# EasyEDA Pro project oxo.epro, board 114514_1
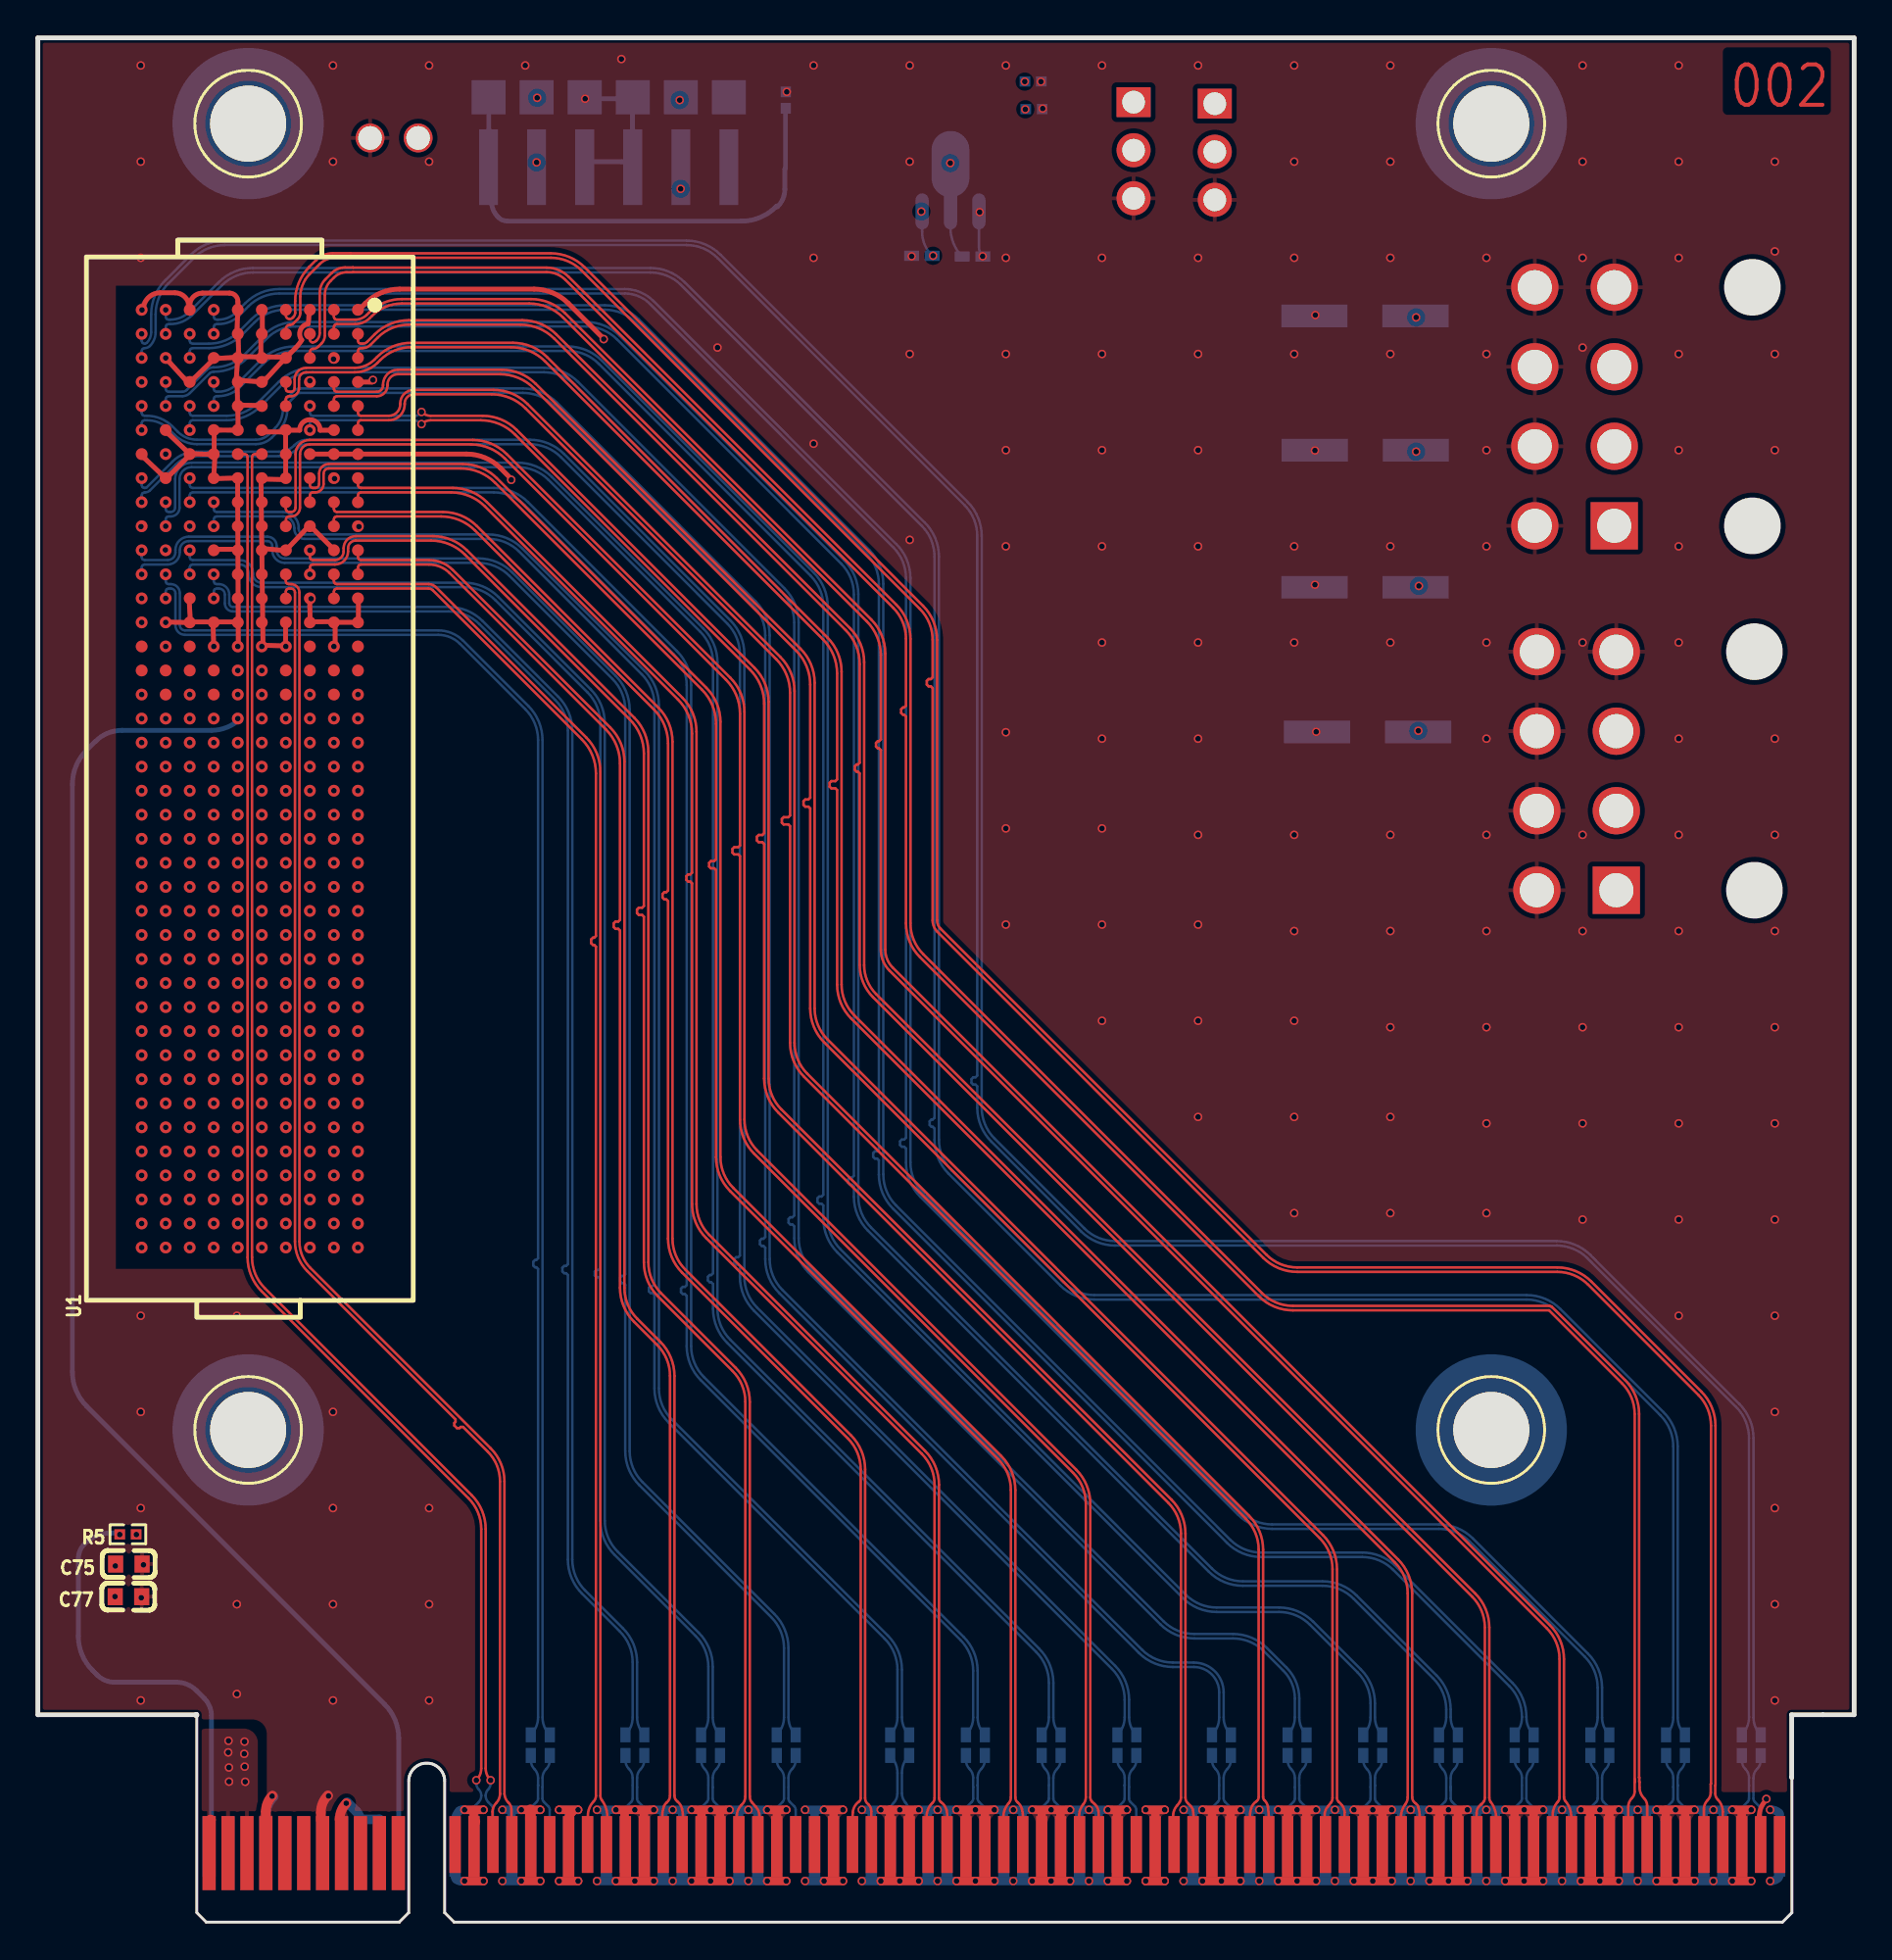
[diagram p0: board, top side]
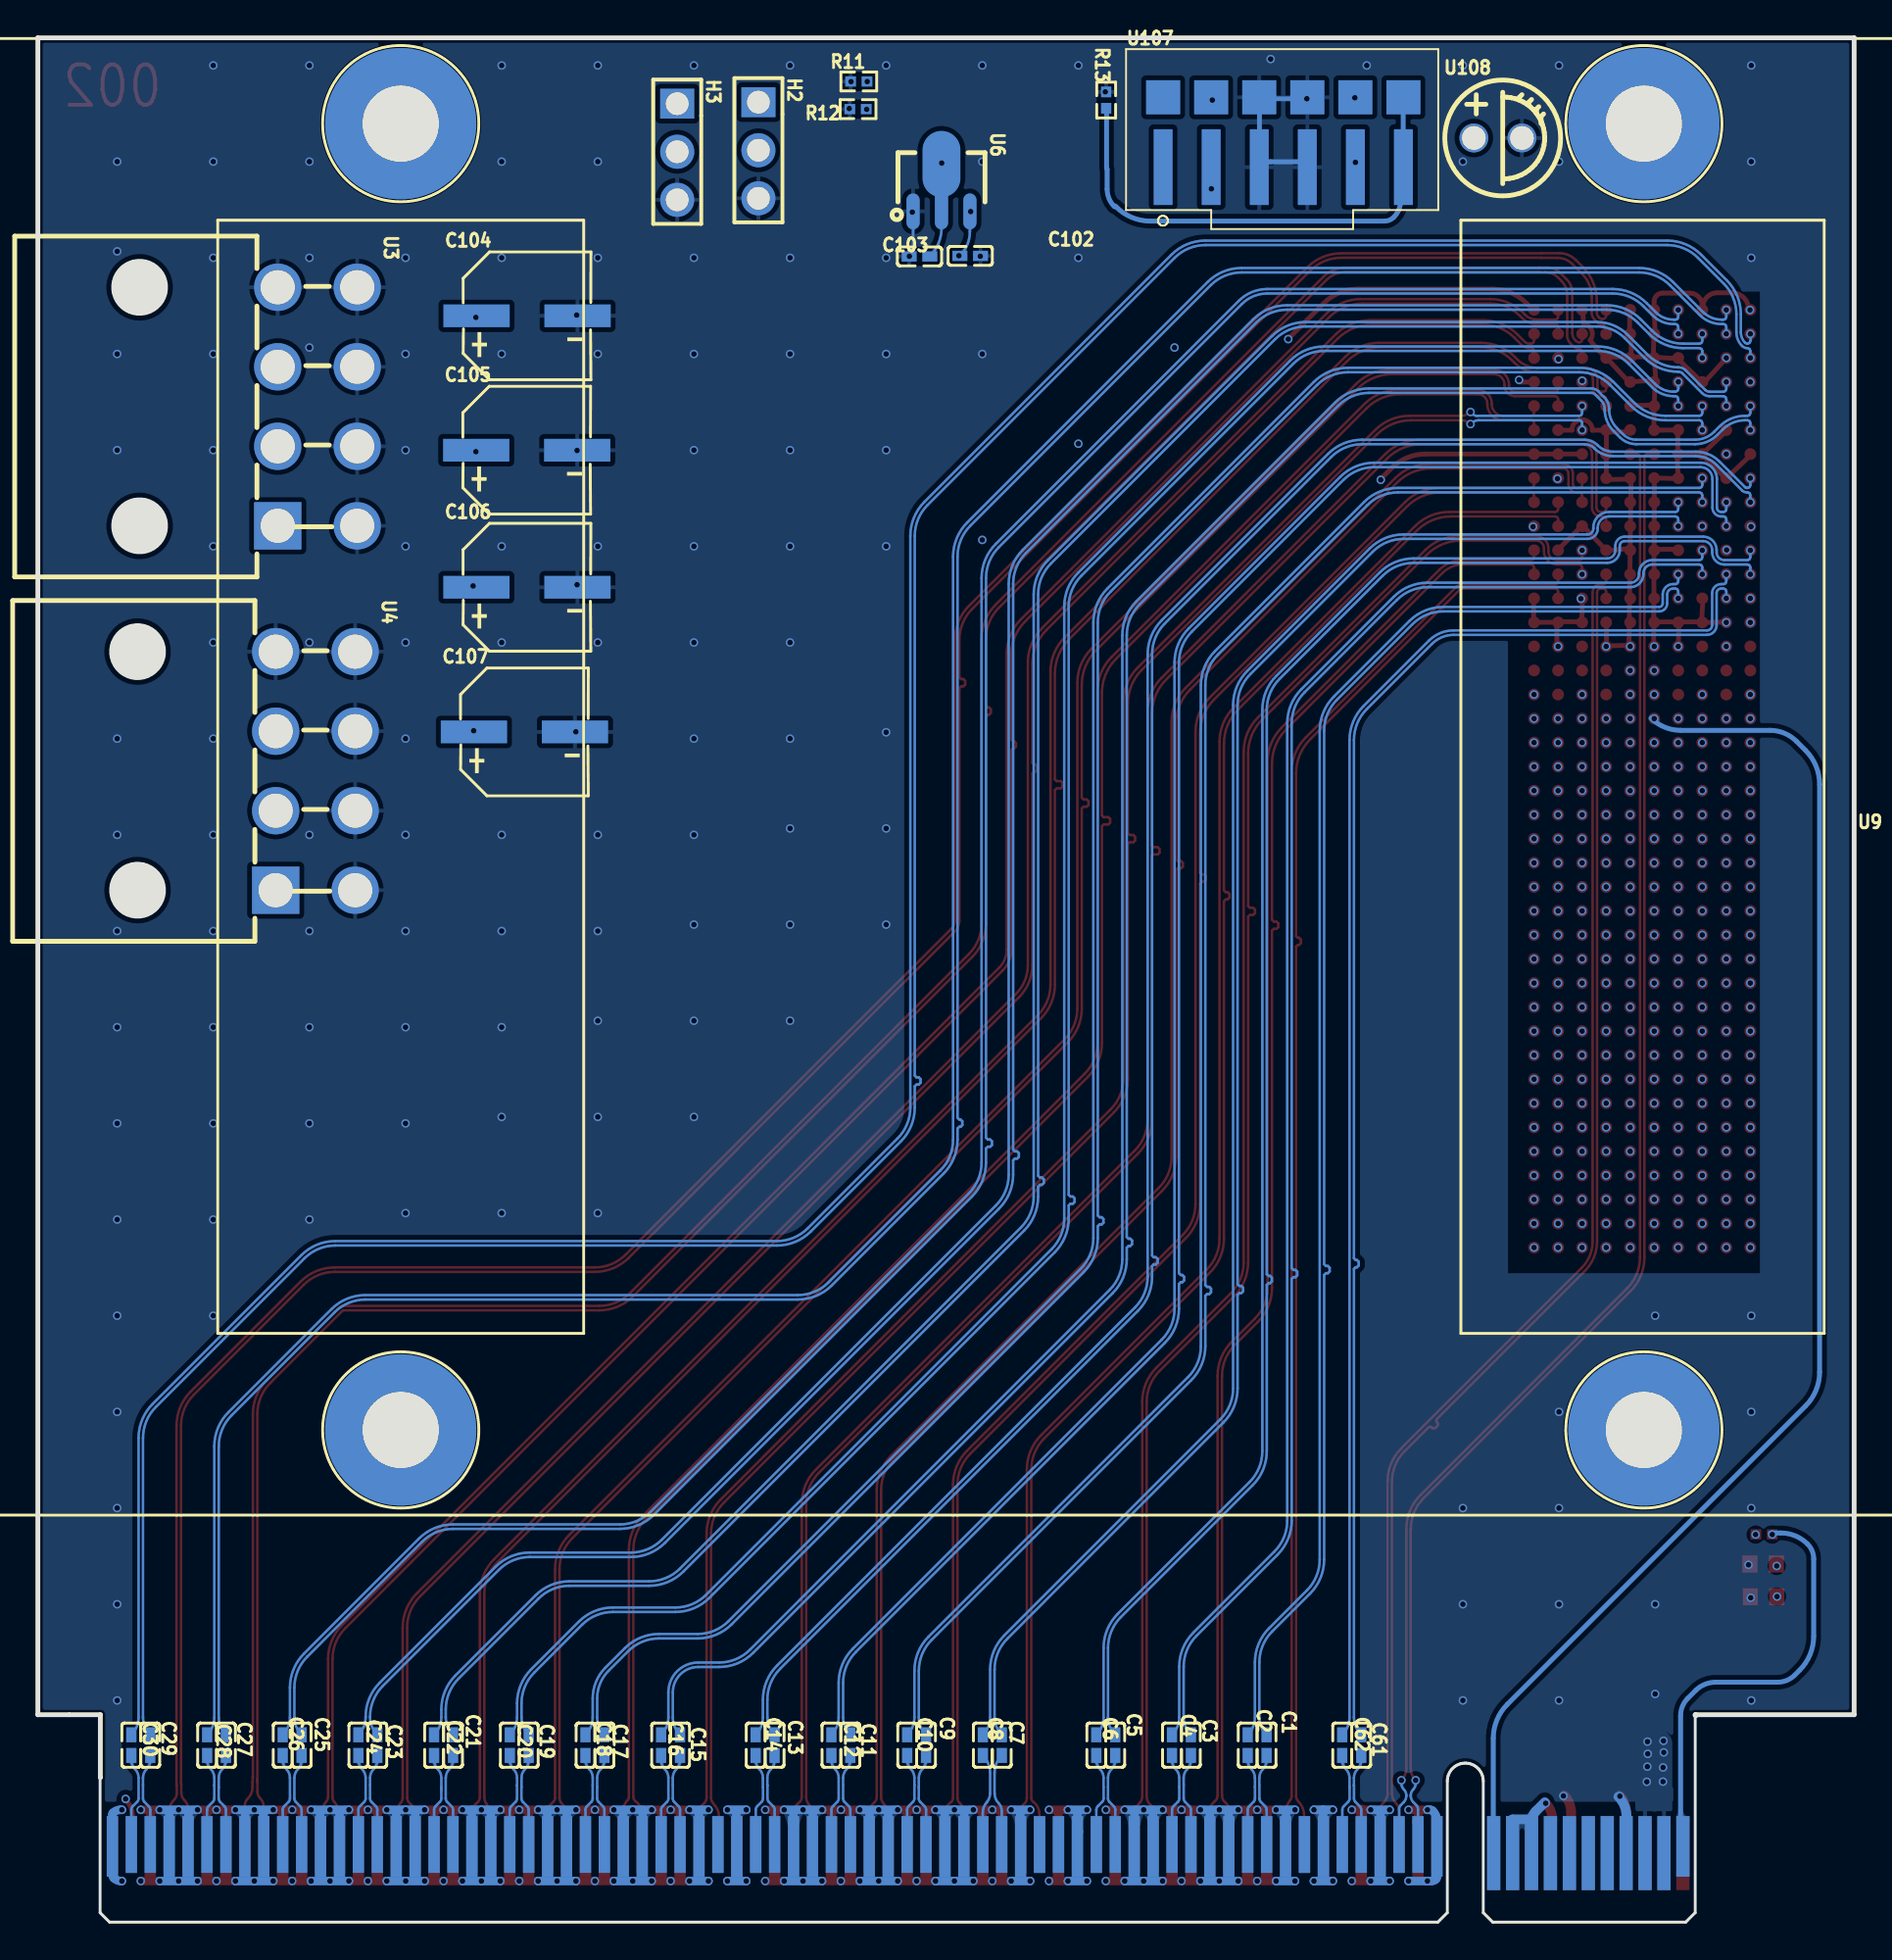
[diagram p1: board, bottom side, seen from below]

Outline 95.99 x 99.53 mm; copper layers: Top Layer, Inner1, Inner2, Inner3, 内层4, Bottom Layer. Coordinates in mm from the lower left corner of the outline.
Outline path: 8.34,10.96 8.34,10.93 8.4,10.93 8.4,10.96 0,10.96 0,99.53 95.99,99.53 95.99,10.96 92.69,10.96 ; 92.69,10.96 92.69,7.65 92.69,7.65
Stack: Top Layer 0.035mm / Dielectric1 1.51mm FR4 er 4.5 / Inner1 0.035mm / Dielectric2 0.274mm FR4 er 4.5 / Inner2 0.035mm / Dielectric3 0.274mm PP er 4.5 / Inner3 0.035mm / Dielectric4 0.274mm PP er 4.5 / 内层4 0.035mm / Dielectric5 0.274mm PP er 4.5 / Bottom Layer 0.035mm

## Design rules (mm)
net CLK+: DP1
net CLK-: DP1
net RX0-: DP2
net RX15+: DP17
net RX15-: DP17
net RX11-: DP13
net RX7-: DP9
net RX0+: DP2
net RX7+: DP9
net RX11+: DP13
net RX14-: DP16
net RX14+: DP16
net RX6-: DP8
net RX3+: DP5
net RX3-: DP5
net RX6+: DP8
net RX10-: DP12
net RX4-: DP6
net RX13+: DP15
net RX13-: DP15
net RX1-: DP3
net RX1+: DP3
net RX4+: DP6
net RX10+: DP12
net RX2+: DP4
net RX2-: DP4
net RX9-: DP11
net RX12+: DP14
net RX9+: DP11
net RX12-: DP14
net RX5-: DP7
net RX5+: DP7
net RX8+: DP10
net RX8-: DP10
net TX8-: DP26
net TX3+: DP21
net TX15+: DP33
net TX7+: DP25
net TX8+: DP26
net TX3-: DP21
net TX7-: DP25
net TX15-: DP33
net TX0-: DP18
net TX11+: DP29
net TX14-: DP32
net TX0+: DP18
net TX6-: DP24
net TX6+: DP24
net TX11-: DP29
net TX14+: DP32
net TX2-: DP20
net TX2+: DP20
net TX5-: DP23
net TX12+: DP30
net TX12-: DP30
net TX9+: DP27
net TX9-: DP27
net TX5+: DP23
net TX1-: DP19
net TX1+: DP19
net TX4-: DP22
net TX10+: DP28
net TX13-: DP31
net TX4+: DP22
net TX10-: DP28
net TX13+: DP31
template: 自定义配置
spacing copperThickness1oz (default): track to track 0.102, other pairs 0.102 to 0.3
spacing copperThickness2oz: track to track 0.203, other pairs 0.152 to 0.3
track width copperThickness1oz (default): min 0.127, default 0.254, max 2.54
track width copperThickness2oz: min 0.203, default 0.254, max 2.54
differential pair differentialPair (default): width min 0.127, default 0.132, max 2.54; gap min 0.102, default 0.102
via viaSize (default): diameter min 0.254, default 0.45, max 10; hole min 0.254, default 0.3, max 6.299

## Placement (name value [footprint] x y rotation side)
C1  220nF  [C0402]  31.05 9.35 90 bottom
C2  220nF  [C0402]  32.05 9.35 90 bottom
C3  220nF  [C0402]  35.05 9.35 90 bottom
C4  220nF  [C0402]  36.05 9.35 90 bottom
C5  220nF  [C0402]  39.05 9.35 90 bottom
C6  220nF  [C0402]  40.05 9.35 90 bottom
C7  220nF  [C0402]  45.05 9.35 90 bottom
C8  220nF  [C0402]  46.05 9.35 90 bottom
C9  220nF  [C0402]  49.05 9.35 90 bottom
C10  220nF  [C0402]  50.05 9.35 90 bottom
C11  220nF  [C0402]  53.05 9.35 90 bottom
C12  220nF  [C0402]  54.05 9.35 90 bottom
C13  220nF  [C0402]  57.06 9.35 90 bottom
C14  220nF  [C0402]  58.06 9.35 90 bottom
C15  220nF  [C0402]  62.05 9.35 90 bottom
C16  220nF  [C0402]  63.05 9.35 90 bottom
C17  220nF  [C0402]  66.05 9.35 90 bottom
C18  220nF  [C0402]  67.05 9.35 90 bottom
C19  220nF  [C0402]  70.05 9.35 90 bottom
C20  220nF  [C0402]  71.05 9.35 90 bottom
C21  220nF  [C0402]  74.05 9.35 90 bottom
C22  220nF  [C0402]  75.05 9.35 90 bottom
C23  220nF  [C0402]  78.05 9.35 90 bottom
C24  220nF  [C0402]  79.05 9.35 90 bottom
C25  220nF  [C0402]  82.05 9.35 90 bottom
C26  220nF  [C0402]  83.05 9.35 90 bottom
C27  220nF  [C0402]  86.05 9.35 90 bottom
C28  220nF  [C0402]  87.05 9.35 90 bottom
C29  220nF  [C0402]  90.05 9.35 90 bottom
C30  220nF  [C0402]  91.05 9.35 90 bottom
C61  220nF  [C0402]  26.05 9.35 90 bottom
C62  220nF  [C0402]  27.06 9.35 90 bottom
C75  10uF  [C0603]  4.81 18.92 0 top
C77  10uF  [C0603]  4.79 17.19 0 top
C102  100nF  [C0402]  46.72 88.02 0 bottom
C103  100nF  [C0402]  49.4 87.99 180 bottom
C104  470uF  [CAP-SMD_BD6.3-L6.6-W6.6-LS7.6-RD]  70.14 84.85 180 bottom
C105  470uF  [CAP-SMD_BD6.3-L6.6-W6.6-LS7.6-RD]  70.15 77.75 180 bottom
C106  470uF  [CAP-SMD_BD6.3-L6.6-W6.6-LS7.6-RD]  70.14 70.51 180 bottom
C107  470uF  [CAP-SMD_BD6.3-L6.6-W6.6-LS7.6-RD]  70.28 62.87 180 bottom
F1  -  [Gold Finger CEM GEN5x16]  50.91 12.95 0 top
H2  2.54-1*3P针  [HDR-TH_3P-P2.54-V-M-1]  57.91 93.59 270 bottom
H3  2.54-1*3P针  [HDR-TH_3P-P2.54-V-M-1]  62.2 93.52 270 bottom
R5  0Ω  [R0402]  4.76 20.48 0 top
R11  100Ω  [R0402]  52.6 97.23 0 bottom
R12  100Ω  [R0402]  52.64 95.77 0 bottom
R13  100Ω  [R0402]  39.53 96.24 90 bottom
U1  84740-102LF  [CONN-SMD_400P-P1.27_84740-002LF]  11.2 60.4 90 top
U3  X9357WR-2x04EH-LPSW  [CONN-TH_8P-P4.20_XKB_X9357WR-2X04EH-N2SW]  81.21 80.06 270 bottom
U4  X9357WR-2x04EH-LPSW  [CONN-TH_8P-P4.20_XKB_X9357WR-2X04EH-N2SW]  81.32 60.81 270 bottom
U6  AMS1117-1.8V  [SOT-89-3_L4.5-W2.5-P1.50-LS4.1-BR]  48.23 91.61 270 bottom
U9  -  [module_sxm2]  43.96 60.5 0 bottom
U107  U107  [ZXDN10S1205SAW-NEWs]  31.44 93.85 180 bottom
U108  -  [电容]  18.57 94.24 180 bottom

## Footprints (pads in the part's own frame, mm; a bottom-side part is the same pattern mirrored in y, then rotated)
C0402
  rect 0.79x0.54 smd: 1(-0.545,0) 2(0.545,0)
C0603
  rect 0.8x0.9 smd: 1(-0.7,0) 2(0.7,0)
CAP-SMD_BD6.3-L6.6-W6.6-LS7.6-RD
  rect 3.5x1.2 smd: 1(-2.67,0) 2(2.67,0)
CONN-SMD_400P-P1.27_84740-002LF
  round 0.623 smd: A1(24.765,-5.715) A2(23.495,-5.715) A3(22.225,-5.715) A4(20.955,-5.715) A5(19.685,-5.715) A6(18.415,-5.715) A7(17.145,-5.715) A8(15.875,-5.715) A9(14.605,-5.715) A10(13.335,-5.715) A11(12.065,-5.715) A12(10.795,-5.715) A13(9.525,-5.715) A14(8.255,-5.715) A15(6.985,-5.715) A16(5.715,-5.715) A17(4.445,-5.715) A18(3.175,-5.715) A19(1.905,-5.715) A20(0.635,-5.715) A21(-0.635,-5.715) A22(-1.905,-5.715) A23(-3.175,-5.715) A24(-4.445,-5.715) A25(-5.715,-5.715) A26(-6.985,-5.715) A27(-8.255,-5.715) A28(-9.525,-5.715) A29(-10.795,-5.715) A30(-12.065,-5.715) A31(-13.335,-5.715) A32(-14.605,-5.715) A33(-15.875,-5.715) A34(-17.145,-5.715) A35(-18.415,-5.715) A36(-19.685,-5.715) A37(-20.955,-5.715) A38(-22.225,-5.715) A39(-23.495,-5.715) A40(-24.765,-5.715) B1(24.765,-4.445) B2(23.495,-4.445) B3(22.225,-4.445) B4(20.955,-4.445) B5(19.685,-4.445) B6(18.415,-4.445) B7(17.145,-4.445) B8(15.875,-4.445) B9(14.605,-4.445) B10(13.335,-4.445) B11(12.065,-4.445) B12(10.795,-4.445) B13(9.525,-4.445) B14(8.255,-4.445) B15(6.985,-4.445) B16(5.715,-4.445) B17(4.445,-4.445) B18(3.175,-4.445) B19(1.905,-4.445) B20(0.635,-4.445) B21(-0.635,-4.445) B22(-1.905,-4.445) B23(-3.175,-4.445) B24(-4.445,-4.445) B25(-5.715,-4.445) B26(-6.985,-4.445) B27(-8.255,-4.445) B28(-9.525,-4.445) B29(-10.795,-4.445) B30(-12.065,-4.445) B31(-13.335,-4.445) B32(-14.605,-4.445) B33(-15.875,-4.445) B34(-17.145,-4.445) B35(-18.415,-4.445) B36(-19.685,-4.445) B37(-20.955,-4.445) B38(-22.225,-4.445) B39(-23.495,-4.445) B40(-24.765,-4.445) C1(24.765,-3.175) C2(23.495,-3.175) C3(22.225,-3.175) C4(20.955,-3.175) C5(19.685,-3.175) C6(18.415,-3.175) C7(17.145,-3.175) C8(15.875,-3.175) C9(14.605,-3.175) C10(13.335,-3.175) C11(12.065,-3.175) C12(10.795,-3.175) C13(9.525,-3.175) C14(8.255,-3.175) C15(6.985,-3.175) C16(5.715,-3.175) C17(4.445,-3.175) C18(3.175,-3.175) C19(1.905,-3.175) C20(0.635,-3.175) C21(-0.635,-3.175) C22(-1.905,-3.175) C23(-3.175,-3.175) C24(-4.445,-3.175) C25(-5.715,-3.175) C26(-6.985,-3.175) C27(-8.255,-3.175) C28(-9.525,-3.175) C29(-10.795,-3.175) C30(-12.065,-3.175) C31(-13.335,-3.175) C32(-14.605,-3.175) C33(-15.875,-3.175) C34(-17.145,-3.175) C35(-18.415,-3.175) C36(-19.685,-3.175) C37(-20.955,-3.175) C38(-22.225,-3.175) C39(-23.495,-3.175) C40(-24.765,-3.175) D1(24.765,-1.905) D2(23.495,-1.905) D3(22.225,-1.905) D4(20.955,-1.905) D5(19.685,-1.905) D6(18.415,-1.905) D7(17.145,-1.905) D8(15.875,-1.905) D9(14.605,-1.905) D10(13.335,-1.905) D11(12.065,-1.905) D12(10.795,-1.905) D13(9.525,-1.905) D14(8.255,-1.905) D15(6.985,-1.905) D16(5.715,-1.905) D17(4.445,-1.905) D18(3.175,-1.905) D19(1.905,-1.905) D20(0.635,-1.905) D21(-0.635,-1.905) D22(-1.905,-1.905) D23(-3.175,-1.905) D24(-4.445,-1.905) D25(-5.715,-1.905) D26(-6.985,-1.905) D27(-8.255,-1.905) D28(-9.525,-1.905) D29(-10.795,-1.905) D30(-12.065,-1.905) D31(-13.335,-1.905) D32(-14.605,-1.905) D33(-15.875,-1.905) D34(-17.145,-1.905) D35(-18.415,-1.905) D36(-19.685,-1.905) D37(-20.955,-1.905) D38(-22.225,-1.905) D39(-23.495,-1.905) D40(-24.765,-1.905) E1(24.765,-0.635) E2(23.495,-0.635) E3(22.225,-0.635) E4(20.955,-0.635) E5(19.685,-0.635) E6(18.415,-0.635) E7(17.145,-0.635) E8(15.875,-0.635) E9(14.605,-0.635) E10(13.335,-0.635) E11(12.065,-0.635) E12(10.795,-0.635) E13(9.525,-0.635) E14(8.255,-0.635) E15(6.985,-0.635) E16(5.715,-0.635) E17(4.445,-0.635) E18(3.175,-0.635) E19(1.905,-0.635) E20(0.635,-0.635) E21(-0.635,-0.635) E22(-1.905,-0.635) E23(-3.175,-0.635) E24(-4.445,-0.635) E25(-5.715,-0.635) E26(-6.985,-0.635) E27(-8.255,-0.635) E28(-9.525,-0.635) E29(-10.795,-0.635) E30(-12.065,-0.635) E31(-13.335,-0.635) E32(-14.605,-0.635) E33(-15.875,-0.635) E34(-17.145,-0.635) E35(-18.415,-0.635) E36(-19.685,-0.635) E37(-20.955,-0.635) E38(-22.225,-0.635) E39(-23.495,-0.635) E40(-24.765,-0.635) F1(24.765,0.635) F2(23.495,0.635) F3(22.225,0.635) F4(20.955,0.635) F5(19.685,0.635) F6(18.415,0.635) F7(17.145,0.635) F8(15.875,0.635) F9(14.605,0.635) F10(13.335,0.635) F11(12.065,0.635) F12(10.795,0.635) F13(9.525,0.635) F14(8.255,0.635) F15(6.985,0.635) F16(5.715,0.635) F17(4.445,0.635) F18(3.175,0.635) F19(1.905,0.635) F20(0.635,0.635) F21(-0.635,0.635) F22(-1.905,0.635) F23(-3.175,0.635) F24(-4.445,0.635) F25(-5.715,0.635) F26(-6.985,0.635) F27(-8.255,0.635) F28(-9.525,0.635) F29(-10.795,0.635) F30(-12.065,0.635) F31(-13.335,0.635) F32(-14.605,0.635) F33(-15.875,0.635) F34(-17.145,0.635) F35(-18.415,0.635) F36(-19.685,0.635) F37(-20.955,0.635) F38(-22.225,0.635) F39(-23.495,0.635) F40(-24.765,0.635) G1(24.765,1.905) G2(23.495,1.905) G3(22.225,1.905) G4(20.955,1.905) G5(19.685,1.905) G6(18.415,1.905) G7(17.145,1.905) G8(15.875,1.905) G9(14.605,1.905) G10(13.335,1.905) G11(12.065,1.905) G12(10.795,1.905) G13(9.525,1.905) G14(8.255,1.905) G15(6.985,1.905) G16(5.715,1.905) G17(4.445,1.905) G18(3.175,1.905) G19(1.905,1.905) G20(0.635,1.905) G21(-0.635,1.905) G22(-1.905,1.905) G23(-3.175,1.905) G24(-4.445,1.905) G25(-5.715,1.905) G26(-6.985,1.905) G27(-8.255,1.905) G28(-9.525,1.905) G29(-10.795,1.905) G30(-12.065,1.905) G31(-13.335,1.905) G32(-14.605,1.905) G33(-15.875,1.905) G34(-17.145,1.905) G35(-18.415,1.905) G36(-19.685,1.905) G37(-20.955,1.905) G38(-22.225,1.905) G39(-23.495,1.905) G40(-24.765,1.905) H1(24.765,3.175) H2(23.495,3.175) H3(22.225,3.175) H4(20.955,3.175) H5(19.685,3.175) H6(18.415,3.175) H7(17.145,3.175) H8(15.875,3.175) H9(14.605,3.175) H10(13.335,3.175) H11(12.065,3.175) H12(10.795,3.175) H13(9.525,3.175) H14(8.255,3.175) H15(6.985,3.175) H16(5.715,3.175) H17(4.445,3.175) H18(3.175,3.175) H19(1.905,3.175) H20(0.635,3.175) H21(-0.635,3.175) H22(-1.905,3.175) H23(-3.175,3.175) H24(-4.445,3.175) H25(-5.715,3.175) H26(-6.985,3.175) H27(-8.255,3.175) H28(-9.525,3.175) H29(-10.795,3.175) H30(-12.065,3.175) H31(-13.335,3.175) H32(-14.605,3.175) H33(-15.875,3.175) H34(-17.145,3.175) H35(-18.415,3.175) H36(-19.685,3.175) H37(-20.955,3.175) H38(-22.225,3.175) H39(-23.495,3.175) H40(-24.765,3.175) J1(24.765,4.445) J2(23.495,4.445) J3(22.225,4.445) J4(20.955,4.445) J5(19.685,4.445) J6(18.415,4.445) J7(17.145,4.445) J8(15.875,4.445) J9(14.605,4.445) J10(13.335,4.445) J11(12.065,4.445) J12(10.795,4.445) J13(9.525,4.445) J14(8.255,4.445) J15(6.985,4.445) J16(5.715,4.445) J17(4.445,4.445) J18(3.175,4.445) J19(1.905,4.445) J20(0.635,4.445) J21(-0.635,4.445) J22(-1.905,4.445) J23(-3.175,4.445) J24(-4.445,4.445) J25(-5.715,4.445) J26(-6.985,4.445) J27(-8.255,4.445) J28(-9.525,4.445) J29(-10.795,4.445) J30(-12.065,4.445) J31(-13.335,4.445) J32(-14.605,4.445) J33(-15.875,4.445) J34(-17.145,4.445) J35(-18.415,4.445) J36(-19.685,4.445) J37(-20.955,4.445) J38(-22.225,4.445) J39(-23.495,4.445) J40(-24.765,4.445) K1(24.765,5.715) K2(23.495,5.715) K3(22.225,5.715) K4(20.955,5.715) K5(19.685,5.715) K6(18.415,5.715) K7(17.145,5.715) K8(15.875,5.715) K9(14.605,5.715) K10(13.335,5.715) K11(12.065,5.715) K12(10.795,5.715) K13(9.525,5.715) K14(8.255,5.715) K15(6.985,5.715) K16(5.715,5.715) K17(4.445,5.715) K18(3.175,5.715) K19(1.905,5.715) K20(0.635,5.715) K21(-0.635,5.715) K22(-1.905,5.715) K23(-3.175,5.715) K24(-4.445,5.715) K25(-5.715,5.715) K26(-6.985,5.715) K27(-8.255,5.715) K28(-9.525,5.715) K29(-10.795,5.715) K30(-12.065,5.715) K31(-13.335,5.715) K32(-14.605,5.715) K33(-15.875,5.715) K34(-17.145,5.715) K35(-18.415,5.715) K36(-19.685,5.715) K37(-20.955,5.715) K38(-22.225,5.715) K39(-23.495,5.715) K40(-24.765,5.715)
CONN-TH_8P-P4.20_XKB_X9357WR-2X04EH-N2SW
  rect 2.5x2.5 hole 1.8: 1(6.3,-2.1)
  round 2.5 hole 1.8: 2(2.1,-2.1) 3(-2.1,-2.1) 4(-6.3,-2.1) 5(6.3,2.1) 6(2.1,2.1) 7(-2.1,2.1) 8(-6.3,2.1)
Gold Finger CEM GEN5x16
  rect 0.7x3.2 smd far side: A1(-41.858,-8.949)
  rect 0.7x3.91 smd far side: A2(-40.858,-9.304) A3(-39.858,-9.304) A4(-38.858,-9.304) A5(-37.858,-9.304) A6(-36.858,-9.304) A7(-35.858,-9.304) A8(-34.858,-9.304) A9(-33.858,-9.304) A10(-32.858,-9.304) A11(-31.858,-9.304)
  rect 0.6x3.2 smd far side: A12(-28.858,-8.949) A15(-25.858,-8.949) A18(-22.858,-8.949) A20(-20.858,-8.949) A23(-17.858,-8.949) A24(-16.858,-8.949) A27(-13.858,-8.949) A28(-12.858,-8.949) A31(-9.858,-8.949) A34(-6.858,-8.949) A37(-3.858,-8.949) A38(-2.858,-8.949) A41(0.142,-8.949) A42(1.142,-8.949) A45(4.142,-8.949) A46(5.142,-8.949) A49(8.142,-8.949) A51(10.142,-8.949) A54(13.142,-8.949) A55(14.142,-8.949) A58(17.142,-8.949) A59(18.142,-8.949) A62(21.142,-8.949) A63(22.142,-8.949) A66(25.142,-8.949) A67(26.142,-8.949) A70(29.142,-8.949) A71(30.142,-8.949) A74(33.142,-8.949) A75(34.142,-8.949) A78(37.142,-8.949) A79(38.142,-8.949) A82(41.142,-8.949)
  rect 0.6x3 smd far side: A13(-27.858,-8.849) A14(-26.858,-8.849) A16(-24.858,-8.849) A17(-23.858,-8.849) A19(-21.858,-8.849) A21(-19.858,-8.849) A22(-18.858,-8.849) A25(-15.858,-8.849) A26(-14.858,-8.849) A29(-11.858,-8.849) A30(-10.858,-8.849) A32(-8.858,-8.849) A33(-7.858,-8.849) A35(-5.858,-8.849) A36(-4.858,-8.849) A39(-1.858,-8.849) A40(-0.858,-8.849) A43(2.142,-8.849) A44(3.142,-8.849) A47(6.142,-8.849) A48(7.142,-8.849) A50(9.142,-8.849) A52(11.142,-8.849) A53(12.142,-8.849) A56(15.142,-8.849) A57(16.142,-8.849) A60(19.142,-8.849) A61(20.142,-8.849) A64(23.142,-8.849) A65(24.142,-8.849) A68(27.142,-8.849) A69(28.142,-8.849) A72(31.142,-8.849) A73(32.142,-8.849) A76(35.142,-8.849) A77(36.142,-8.849) A80(39.142,-8.849) A81(40.142,-8.849)
  rect 0.7x3.91 smd: B1(-41.858,-9.304) B2(-40.858,-9.304) B3(-39.858,-9.304) B4(-38.858,-9.304) B5(-37.858,-9.304) B6(-36.858,-9.304) B7(-35.858,-9.304) B8(-34.858,-9.304) B9(-33.858,-9.304) B10(-32.858,-9.304) B11(-31.858,-9.304)
  rect 0.6x3 smd: B12(-28.858,-8.849) B14(-26.858,-8.849) B15(-25.858,-8.849) B17(-23.858,-8.849) B19(-21.858,-8.849) B20(-20.858,-8.849) B23(-17.858,-8.849) B24(-16.858,-8.849) B27(-13.858,-8.849) B28(-12.858,-8.849) B30(-10.858,-8.849) B31(-9.858,-8.849) B33(-7.858,-8.849) B34(-6.858,-8.849) B37(-3.858,-8.849) B38(-2.858,-8.849) B41(0.142,-8.849) B42(1.142,-8.849) B45(4.142,-8.849) B46(5.142,-8.849) B48(7.142,-8.849) B50(9.142,-8.849) B51(10.142,-8.849) B54(13.142,-8.849) B55(14.142,-8.849) B58(17.142,-8.849) B59(18.142,-8.849) B62(21.142,-8.849) B63(22.142,-8.849) B66(25.142,-8.849) B67(26.142,-8.849) B70(29.142,-8.849) B71(30.142,-8.849) B74(33.142,-8.849) B75(34.142,-8.849) B78(37.142,-8.849) B79(38.142,-8.849) B81(40.142,-8.849) B82(41.142,-8.849)
  rect 0.6x3.2 smd: B13(-27.858,-8.949) B16(-24.858,-8.949) B18(-22.858,-8.949) B21(-19.858,-8.949) B22(-18.858,-8.949) B25(-15.858,-8.949) B26(-14.858,-8.949) B29(-11.858,-8.949) B32(-8.858,-8.949) B35(-5.858,-8.949) B36(-4.858,-8.949) B39(-1.858,-8.949) B40(-0.858,-8.949) B43(2.142,-8.949) B44(3.142,-8.949) B47(6.142,-8.949) B49(8.142,-8.949) B52(11.142,-8.949) B53(12.142,-8.949) B56(15.142,-8.949) B57(16.142,-8.949) B60(19.142,-8.949) B61(20.142,-8.949) B64(23.142,-8.949) B65(24.142,-8.949) B68(27.142,-8.949) B69(28.142,-8.949) B72(31.142,-8.949) B73(32.142,-8.949) B76(35.142,-8.949) B77(36.142,-8.949) B80(39.142,-8.949)
HDR-TH_3P-P2.54-V-M-1
  rect 1.575x1.8 hole 1.2: 1(-2.54,0)
  round 1.8 hole 1.2: 2(0,0) 3(2.54,0)
module_sxm2
  round 4.013 hole 4.013: MH2(32.85,34.5) MH3(-32.85,34.5) MH6(32.85,-34.5) MH7(-32.85,-34.5)
R0402
  rect 0.566x0.54 smd: 1(-0.433,0) 2(0.433,0)
SOT-89-3_L4.5-W2.5-P1.50-LS4.1-BR
  oval 1.9x0.7 smd: 1(1.25,-1.501) 3(1.25,1.501)
  oval 3.5x2 smd: 2(-1.25,0)
  oval 2.1x0.7 smd: 2(1.151,0)
ZXDN10S1205SAW-NEWs
  rect 1x4 smd: 1(-5.08,-1.15) 2(-2.54,-1.15) 3(0,-1.15) 4(2.54,-1.15) 5(5.08,-1.15) 6(7.62,-1.15)
  rect 1.8x1.8 smd: 1(-5.08,2.54) 2(-2.54,2.54) 3(0,2.54) 4(2.54,2.54) 5(5.08,2.54) 6(7.62,2.54)
电容
  round 1.524 hole 1.25: 1(-1.524,0) 2(1.016,0)

## Nets
+1V8: C103.2 H2.1 H3.1 U6.2
+3V3: F1.A9 F1.A10 F1.B8
+5V: C102.2 U1.F20 U1.G20 U1.H20 U1.J20 U1.K20 U6.3 U107.5 U108.1
+12V: C75.1 C77.1 C104.1 C105.1 C106.1 C107.1 F1.A2 F1.A3 F1.B1 F1.B2 F1.B3 U1.A22 U1.A23 U1.A25 U1.A26 U1.A28 U1.A29 U1.A31 U1.A32 U1.A34 U1.A35 U1.A37 U1.A38 U1.A40 U1.B22 U1.B23 U1.B25 U1.B26 U1.B28 U1.B29 U1.B31 U1.B32 U1.B34 U1.B35 U1.B37 U1.B38 U1.B40 U1.C22 U1.C23 U1.C25 U1.C26 U1.C28 U1.C29 U1.C31 U1.C32 U1.C34 U1.C35 U1.C37 U1.C38 U1.C40 U1.D22 U1.D23 U1.D25 U1.D26 U1.D28 U1.D29 U1.D31 U1.D32 U1.D34 U1.D35 U1.D37 U1.D38 U1.D40 U1.E22 U1.E23 U1.E25 U1.E26 U1.E28 U1.E29 U1.E31 U1.E32 U1.E34 U1.E35 U1.E37 U1.E38 U1.E40 U1.F22 U1.F23 U1.F25 U1.F26 U1.F28 U1.F29 U1.F31 U1.F32 U1.F34 U1.F35 U1.F37 U1.F38 U1.F40 U1.G22 U1.G23 U1.G25 U1.G26 U1.G28 U1.G29 U1.G31 U1.G32 U1.G34 U1.G35 U1.G37 U1.G38 U1.G40 U1.H22 U1.H23 U1.H25 U1.H26 U1.H28 U1.H29 U1.H31 U1.H32 U1.H34 U1.H35 U1.H37 U1.H38 U1.H40 U1.J22 U1.J23 U1.J25 U1.J26 U1.J28 U1.J29 U1.J31 U1.J32 U1.J34 U1.J35 U1.J37 U1.J38 U1.J40 U1.K22 U1.K23 U1.K25 U1.K26 U1.K28 U1.K29 U1.K31 U1.K32 U1.K34 U1.K35 U1.K37 U1.K38 U1.K40 U3.1 U3.2 U3.3 U4.1 U4.2 U4.3 U107.2
GND: C75.2 C77.2 C102.1 C103.1 C104.2 C105.2 C106.2 C107.2 F1.A4 F1.A12 F1.A15 F1.A18 F1.A20 F1.A23 F1.A24 F1.A27 F1.A28 F1.A31 F1.A34 F1.A37 F1.A38 F1.A41 F1.A42 F1.A45 F1.A46 F1.A49 F1.A51 F1.A54 F1.A55 F1.A58 F1.A59 F1.A62 F1.A63 F1.A66 F1.A67 F1.A70 F1.A71 F1.A74 F1.A75 F1.A78 F1.A79 F1.A82 F1.B4 F1.B7 F1.B13 F1.B16 F1.B18 F1.B21 F1.B22 F1.B25 F1.B26 F1.B29 F1.B32 F1.B35 F1.B36 F1.B39 F1.B40 F1.B43 F1.B44 F1.B47 F1.B49 F1.B52 F1.B53 F1.B56 F1.B57 F1.B60 F1.B61 F1.B64 F1.B65 F1.B68 F1.B69 F1.B72 F1.B73 F1.B76 F1.B77 F1.B80 H2.3 H3.3 R11.2 R12.2 R13.2 U1.A1 U1.A4 U1.A7 U1.A10 U1.A13 U1.A14 U1.A17 U1.A21 U1.A24 U1.A27 U1.A30 U1.A33 U1.A36 U1.A39 U1.B3 U1.B6 U1.B7 U1.B8 U1.B11 U1.B14 U1.B15 U1.B18 U1.B19 U1.B21 U1.B24 U1.B27 U1.B30 U1.B33 U1.B36 U1.B39 U1.C1 U1.C4 U1.C7 U1.C10 U1.C13 U1.C14 U1.C17 U1.C21 U1.C24 U1.C27 U1.C30 U1.C33 U1.C36 U1.C39 U1.D3 U1.D6 U1.D7 U1.D8 U1.D11 U1.D14 U1.D15 U1.D18 U1.D19 U1.D21 U1.D24 U1.D27 U1.D30 U1.D33 U1.D36 U1.D39 U1.E1 U1.E2 U1.E3 U1.E4 U1.E5 U1.E6 U1.E8 U1.E9 U1.E10 U1.E11 U1.E12 U1.E13 U1.E14 U1.E15 U1.E16 U1.E17 U1.E19 U1.E21 U1.E24 U1.E27 U1.E30 U1.E33 U1.E36 U1.E39 U1.F1 U1.F2 U1.F3 U1.F4 U1.F5 U1.F6 U1.F8 U1.F9 U1.F10 U1.F11 U1.F12 U1.F13 U1.F14 U1.F15 U1.F16 U1.F17 U1.F19 U1.F21 U1.F24 U1.F27 U1.F30 U1.F33 U1.F36 U1.F39 U1.G3 U1.G6 U1.G7 U1.G8 U1.G11 U1.G14 U1.G15 U1.G18 U1.G19 U1.G21 U1.G24 U1.G27 U1.G30 U1.G33 U1.G36 U1.G39 U1.H1 U1.H4 U1.H7 U1.H10 U1.H13 U1.H14 U1.H17 U1.H19 U1.H21 U1.H24 U1.H27 U1.H30 U1.H33 U1.H36 U1.H39 U1.J3 U1.J6 U1.J8 U1.J11 U1.J14 U1.J15 U1.J18 U1.J19 U1.J21 U1.J24 U1.J27 U1.J30 U1.J33 U1.J36 U1.J39 U1.K1 U1.K4 U1.K7 U1.K10 U1.K13 U1.K14 U1.K17 U1.K19 U1.K21 U1.K24 U1.K27 U1.K30 U1.K33 U1.K36 U3.4 U3.5 U3.6 U3.7 U3.8 U4.4 U4.5 U4.6 U4.7 U4.8 U6.1 U107.3 U107.4 U108.2
ADJ: R13.1 U107.6
CLK+: F1.A13 U1.F7
CLK-: F1.A14 U1.E7
EN: U107.1
I2CADDR0: R11.1 U1.H18
I2CADDR1: R12.1 U1.C18
JTAG_SEL: U1.C19
JTAG_TCLK: U1.C20
JTAG_TDI: U1.E20
JTAG_TDO: U1.D20
JTAG_TMS: U1.B20
JTAG_TRST#: U1.A20
PCIET0+: C61.1 F1.A16
PCIET0-: C62.1 F1.A17
PCIET1+: C1.1 F1.A21
PCIET1-: C2.1 F1.A22
PCIET2+: C3.1 F1.A25
PCIET2-: C4.1 F1.A26
PCIET3+: C5.1 F1.A29
PCIET3-: C6.1 F1.A30
PCIET4+: C7.1 F1.A35
PCIET4-: C8.1 F1.A36
PCIET5+: C9.1 F1.A39
PCIET5-: C10.1 F1.A40
PCIET6+: C11.1 F1.A43
PCIET6-: C12.1 F1.A44
PCIET7+: C13.1 F1.A47
PCIET7-: C14.1 F1.A48
PCIET8+: C15.1 F1.A52
PCIET8-: C16.1 F1.A53
PCIET9+: C17.1 F1.A56
PCIET9-: C18.1 F1.A57
PCIET10+: C19.1 F1.A60
PCIET10-: C20.1 F1.A61
PCIET11+: C21.1 F1.A64
PCIET11-: C22.1 F1.A65
PCIET12+: C23.1 F1.A68
PCIET12-: C24.1 F1.A69
PCIET13+: C25.1 F1.A72
PCIET13-: C26.1 F1.A73
PCIET14+: C27.1 F1.A76
PCIET14-: C28.1 F1.A77
PCIET15+: C29.1 F1.A80
PCIET15-: C30.1 F1.A81
PERST#: F1.A11 U1.F18
PRSNT1: F1.A1 R5.1
PRSNT2: F1.B17 F1.B31 F1.B48 F1.B81 R5.2
PRSNT2#_SXM: U1.J7
PWR_BRAKE#: U1.E18
PWR_EN: H2.2 U1.A18
PWR_GOOD: U1.K18
RX0+: F1.B14 U1.D13
RX0-: F1.B15 U1.D12
RX1+: F1.B19 U1.B13
RX1-: F1.B20 U1.B12
RX2+: F1.B23 U1.A12
RX2-: F1.B24 U1.A11
RX3+: F1.B27 U1.C12
RX3-: F1.B28 U1.C11
RX4+: F1.B33 U1.B10
RX4-: F1.B34 U1.B9
RX5+: F1.B37 U1.A9
RX5-: F1.B38 U1.A8
RX6+: F1.B41 U1.C9
RX6-: F1.B42 U1.C8
RX7+: F1.B45 U1.D10
RX7-: F1.B46 U1.D9
RX8+: F1.B50 U1.C6
RX8-: F1.B51 U1.C5
RX9+: F1.B54 U1.A6
RX9-: F1.B55 U1.A5
RX10+: F1.B58 U1.B5
RX10-: F1.B59 U1.B4
RX11+: F1.B62 U1.D5
RX11-: F1.B63 U1.D4
RX12+: F1.B66 U1.A3
RX12-: F1.B67 U1.A2
RX13+: F1.B70 U1.B2
RX13-: F1.B71 U1.B1
RX14+: F1.B74 U1.C3
RX14-: F1.B75 U1.C2
RX15+: F1.B78 U1.D2
RX15-: F1.B79 U1.D1
SXM_PRSNT2: U1.K39
THERM_OVER#: H3.2 U1.A19
TX0+: C61.2 U1.J13
TX0-: C62.2 U1.J12
TX1+: C1.2 U1.G13
TX1-: C2.2 U1.G12
TX2+: C3.2 U1.H12
TX2-: C4.2 U1.H11
TX3+: C5.2 U1.K12
TX3-: C6.2 U1.K11
TX4+: C7.2 U1.G10
TX4-: C8.2 U1.G9
TX5+: C9.2 U1.H9
TX5-: C10.2 U1.H8
TX6+: C11.2 U1.J10
TX6-: C12.2 U1.J9
TX7+: C13.2 U1.K9
TX7-: C14.2 U1.K8
TX8+: C15.2 U1.K6
TX8-: C16.2 U1.K5
TX9+: C17.2 U1.H6
TX9-: C18.2 U1.H5
TX10+: C19.2 U1.G5
TX10-: C20.2 U1.G4
TX11+: C21.2 U1.J5
TX11-: C22.2 U1.J4
TX12+: C23.2 U1.H3
TX12-: C24.2 U1.H2
TX13+: C25.2 U1.G2
TX13-: C26.2 U1.G1
TX14+: C27.2 U1.J2
TX14-: C28.2 U1.J1
TX15+: C29.2 U1.K3
TX15-: C30.2 U1.K2

Pads without a net: F1 A5 A6 A7 A8 A19 A32 A33 A50 B5 B6 B9 B10 B11 B12 B30 B82; U1 A15 A16 B16 B17 C15 C16 D16 D17 G16 G17 H15 H16 J16 J17 K15 K16; U9 MH2 MH3 MH6 MH7

## Via types
v1: diameter 0.45, hole 0.299, Top Layer to Bottom Layer, 189 vias
v2: diameter 0.45, hole 0.3, Top Layer to Bottom Layer, 427 vias

## Routing (per net, layer and track width the routed paths; a pad name or vN(x,y) marks a point on that pad's centre or on a via; arc(x,y) is an arc through that point)
+1V8: length 13.5
  Inner3 w0.508: 48.3,92.96 52.34,92.96 arc(52.95,93.08) 53.47,93.43 55.62,95.58 arc(56.19,95.96) 56.85,96.09 57.97,96.09
  Bottom Layer w0.132: U6.2 48.23,89.48 arc(48.39,88.67) C103.2
  vias: v1(48.22,92.92)
+3V3: length 3.2
  Top Layer w0.508: 15.95,5.41 15.95,5.43 arc(16.04,5.89) 16.31,6.29
  Bottom Layer w0.508: 16.35,6.33 16.84,5.84 arc(16.98,5.63) 17.03,5.38 ; 17.06,5.43 18.05,5.43 arc(18.08,5.42) 18.1,5.41
  vias: v1(16.3,6.28)
+5V: length 31.5
  Inner2 w0.254: 9.29,61.05 9.29,61.04
  Inner3 w0.254: 46.62,90.43 41.23,90.43 arc(40.25,90.62) 39.43,91.17 37.91,92.69 arc(37.36,93.51) 37.17,94.48 37.17,96.18 arc(37.01,96.99) 36.55,97.67 36.25,97.97 arc(35.82,98.26) 35.32,98.36 32.43,98.36 arc(31.49,98.17) 30.69,97.63 30.63,97.58 arc(30.08,96.76) 29.89,95.78 29.89,93.88 arc(29.83,93.6) 29.67,93.36 arc(29.39,93.17) 29.06,93.11 26.41,93.11
  Bottom Layer w0.132: U6.3 46.73,89.29 arc(46.87,88.6) C102.2
  vias: v1(26.39,96.36) v1(26.36,92.95) v1(46.69,90.35) v1(47.31,88.02) v2(5.49,61.03) v2(6.76,61.03) v2(8.03,61.03) v2(9.3,61.03) v2(10.57,61.03)
+12V: length 0
  Top Layer w0.508: 9.15,5.41 9.13,5.43
  vias: v1(4.09,18.81) v1(4.08,17.2) v1(10.08,9.58) v1(10.06,8.97) v1(10.1,8.17) v1(10.1,7.42) v1(10.91,8.89) v1(10.92,9.54) v1(10.93,8.21) v1(10.96,7.41) v1(33.92,96.24) v1(33.97,91.56) v1(72.84,84.76) v1(72.84,77.67) v1(72.99,70.58) v1(72.96,62.93) v2(5.49,58.49) v2(5.49,57.22) v2(5.49,54.68) v2(5.49,53.41) v2(5.49,50.87) v2(5.49,49.6) v2(5.49,47.06) v2(5.49,45.79) v2(5.49,43.25) v2(5.49,41.98) v2(5.49,39.44) v2(5.49,38.17) v2(5.49,35.63) v2(6.76,58.49) v2(6.76,57.22) v2(6.76,54.68) v2(6.76,53.41) v2(6.76,50.87) v2(6.76,49.6) v2(6.76,47.06) v2(6.76,45.79) v2(6.76,43.25) v2(6.76,41.98) v2(6.76,39.44) v2(6.76,38.17) v2(6.76,35.63) v2(8.03,58.49) v2(8.03,57.22) v2(8.03,54.68) v2(8.03,53.41) v2(8.03,50.87) v2(8.03,49.6) v2(8.03,47.06) v2(8.03,45.79) v2(8.03,43.25) v2(8.03,41.98) v2(8.03,39.44) v2(8.03,38.17) v2(8.03,35.63) v2(9.3,58.49) v2(9.3,57.22) v2(9.3,54.68) v2(9.3,53.41) v2(9.3,50.87) v2(9.3,49.6) v2(9.3,47.06) v2(9.3,45.79) v2(9.3,43.25) v2(9.3,41.98) v2(9.3,39.44) v2(9.3,38.17) v2(9.3,35.63) v2(10.57,58.49) v2(10.57,57.22) v2(10.57,54.68) v2(10.57,53.41) v2(10.57,50.87) v2(10.57,49.6) v2(10.57,47.06) v2(10.57,45.79) v2(10.57,43.25) v2(10.57,41.98) v2(10.57,39.44) v2(10.57,38.17) v2(10.57,35.63) v2(11.84,58.49) v2(11.84,57.22) v2(11.84,54.68) v2(11.84,53.41) v2(11.84,50.87) v2(11.84,49.6) v2(11.84,47.06) v2(11.84,45.79) v2(11.84,43.25) v2(11.84,41.98) v2(11.84,39.44) v2(11.84,38.17) v2(11.84,35.63) v2(13.11,58.49) v2(13.11,57.22) v2(13.11,54.68) v2(13.11,53.41) v2(13.11,50.87) v2(13.11,49.6) v2(13.11,47.06) v2(13.11,45.79) v2(13.11,43.25) v2(13.11,41.98) v2(13.11,39.44) v2(13.11,38.17) v2(13.11,35.63) v2(14.38,58.49) v2(14.38,57.22) v2(14.38,54.68) v2(14.38,53.41) v2(14.38,50.87) v2(14.38,49.6) v2(14.38,47.06) v2(14.38,45.79) v2(14.38,43.25) v2(14.38,41.98) v2(14.38,39.44) v2(14.38,38.17) v2(14.38,35.63) v2(15.65,58.49) v2(15.65,57.22) v2(15.65,54.68) v2(15.65,53.41) v2(15.65,50.87) v2(15.65,49.6) v2(15.65,47.06) v2(15.65,45.79) v2(15.65,43.25) v2(15.65,41.98) v2(15.65,39.44) v2(15.65,38.17) v2(15.65,35.63) v2(16.92,58.49) v2(16.92,57.22) v2(16.92,54.68) v2(16.92,53.41) v2(16.92,50.87) v2(16.92,49.6) v2(16.92,47.06) v2(16.92,45.79) v2(16.92,43.25) v2(16.92,41.98) v2(16.92,39.44) v2(16.92,38.17) v2(16.92,35.63)
GND: length 324.8
  Top Layer w0.254: 9.32,78.76 9.32,77.55 ; 14.43,68.68 15.62,68.7 ; 8.02,85.31 8.02,85.37 arc(8.22,85.85) 8.7,86.05 10.13,86.05 arc(10.44,85.92) 10.57,85.6 10.57,85.19 ; 10.59,78.78 10.59,78.81 ; 10.59,78.81 9.4,78.81 ; 10.59,78.81 10.56,80.2 ; 10.52,84.06 10.57,85.15 ; 11.79,82.68 11.81,82.68 ; 11.81,82.68 arc(11.79,82.73) 11.79,82.78 11.79,83.9 ; 11.81,82.68 arc(11.83,82.63) 11.87,82.59 ; 25,76.25 24.45,76.8 arc(23.62,77.35) 22.65,77.55 14.36,77.55 ; 16.94,69.97 16.94,68.66 15.71,68.66 ; 15.71,68.66 15.64,68.66 ; 15.71,68.66 15.71,67.38 ; 15.71,68.66 15.71,68.7 ; 9.36,77.55 9.29,76.25 10.52,76.28 ; 13.09,67.41 13.09,68.64 ; 13.09,67.41 11.9,67.45 11.84,72.46 11.79,76.28 ; 13.09,67.41 13.13,67.41 ; 6.64,78.73 6.78,78.73 6.82,78.74 ; 29.91,83.63 28.03,85.51 arc(27.2,86.06) 26.23,86.26 19.11,86.26 arc(18.14,86.06) 17.32,85.51 16.9,85.1 ; 13.14,82.67 13.58,83.11 arc(13.78,83.33) 13.95,83.57 arc(13.87,84.09) 14.28,84.43 arc(14.32,84.67) 14.33,84.91 14.33,85.02 ; 9.32,77.49 9.32,77.52 8.04,77.57 ; 10.58,83.92 10.62,82.7 11.78,82.67 ; 15.63,72.52 14.36,73.78 13.09,72.44 11.94,72.55 ; 9.26,68.68 8.06,68.68 ; 9.26,68.68 10.52,68.68 ; 9.26,68.68 9.26,68.71 ; 9.26,68.68 9.29,67.48 ; 5.5,77.46 6.77,76.25 ; 7.94,77.63 6.8,78.71 ; 6.75,68.68 8.05,68.64 ; 10.57,72.52 10.56,75 10.56,76.32 ; 10.48,81.39 10.57,82.66 9.28,82.59 ; 11.87,78.72 13.1,78.72 13.1,77.48 ; 13.1,77.48 13.09,76.2 11.81,76.23 ; 9.29,72.52 10.41,72.52 ; 13.12,78.81 13.84,78.81 arc(14.37,79.35) 14.92,78.82 arc(14.92,78.81) 14.92,78.81 15.54,78.81 arc(15.58,78.8) 15.62,78.77 ; 10.53,81.45 11.9,81.35 ; 11.88,80.11 10.58,80.13 ; 16.97,81.35 17.67,81.35 17.67,81.44 ; 9.33,77.52 9.32,77.52 ; 9.27,82.53 7.99,81.29 ; 13.1,77.43 13.06,77.43 ; 8.01,81.23 6.77,82.6 ; 13.08,82.63 11.86,81.3 ; 7.99,69.98 8.06,68.71 ; 11.87,83.91 11.87,85.19 ; 14.36,70.05 14.39,68.6 ; 11.87,82.68 13.25,82.66 ; 10.58,72.46 10.6,67.41 ; 6.8,76.25 8.01,77.48 ; 10.56,80.12 10.53,81.39 ; 5.57,85.17 arc(5.83,85.8) 6.47,86.06 7.24,86.06 arc(7.77,85.84) 7.99,85.32
  Top Layer w0.45: v2(61.55,2.17) v2(62.55,2.17) v2(63.55,2.17) ; 31.01,5.9 31.01,5.5 arc(31.02,5.42) 31.06,5.36 ; v2(32.55,5.93) v2(31.55,5.93) v2(30.55,5.93) ; 46.06,5.85 46.06,4.99 arc(46.06,4.98) 46.06,4.98 ; v2(38.55,2.17) v2(39.55,2.17) ; v2(67.55,5.93) v2(66.55,5.93) v2(65.55,5.93) ; 66.06,5.87 66.06,5.32 arc(66.04,5.26) 66.01,5.21 ; v2(61.55,5.93) v2(62.55,5.93) v2(63.55,5.93) ; 50.05,5.89 50.05,5.01 arc(50.04,4.96) 50.01,4.91 ; v2(81.55,5.93) v2(82.55,5.93) v2(83.55,5.93) ; v2(34.55,2.17) v2(35.55,2.17) v2(36.55,2.17) ; 87.06,5.91 87.06,4.88 arc(87.06,4.87) 87.06,4.87 ; v2(85.55,5.93) v2(86.55,5.93) v2(87.55,5.93) ; v2(44.55,5.93) 45.04,5.93 ; 45.04,5.93 45.04,5.06 ; 45.04,5.93 45.04,5.94 ; 45.04,5.93 v2(45.55,5.93) v2(46.55,5.93) ; 42.05,5.89 42.05,5.15 arc(42.04,5.09) 42,5.03 ; v2(46.55,2.17) v2(45.55,2.17) v2(44.55,2.17) ; 67.04,5.87 67.04,5.17 arc(67.05,5.15) 67.06,5.13 ; v2(75.55,2.17) v2(74.55,2.17) v2(73.55,2.17) ; 75.05,5.9 75.05,5.3 arc(75.05,5.26) 75.02,5.23 ; v2(79.55,5.93) v2(78.55,5.93) v2(77.55,5.93) ; v2(73.55,5.93) v2(74.55,5.93) v2(75.55,5.93) ; v2(22.55,2.17) v2(23.55,2.17) ; 32.03,5.88 32.03,5.29 ; 28.27,5.84 28.2,5.78 arc(28.07,5.59) 28.03,5.36 ; 57.03,5.78 57.03,5.09 arc(57.03,5.06) 57,5.02 ; 39.06,5.86 39.06,5.03 arc(39.05,4.99) 39.03,4.96 ; 49.06,5.8 49.06,5.16 arc(49.07,5.13) 49.08,5.11 ; 23.04,5.91 23.04,5.29 arc(23.04,5.28) 23.04,5.27 ; v2(81.55,2.17) v2(82.55,2.17) v2(83.55,2.17) ; 54.05,5.87 54.05,5.13 arc(54.04,5.1) 54.02,5.07 ; v2(36.55,5.93) v2(35.55,5.93) v2(34.55,5.93) ; 78.04,5.9 78.04,5.03 arc(78.03,4.97) 78,4.92 ; v2(52.55,2.17) v2(53.55,2.17) v2(54.55,2.17) ; v2(58.55,5.93) v2(59.55,5.93) ; v2(71.55,2.17) v2(70.55,2.17) v2(69.55,2.17) ; v2(50.55,2.17) v2(49.55,2.17) v2(48.55,2.17) ; v2(25.55,5.93) v2(26.55,5.93) ; v2(89.55,2.17) v2(90.55,2.17) ; v2(54.55,5.93) v2(53.55,5.93) v2(52.55,5.93) ; v2(79.55,2.17) v2(78.55,2.17) v2(77.55,2.17) ; 53.05,4.74 53.05,5.87 arc(53.05,5.88) 53.05,5.89 ; v2(38.55,5.93) v2(39.55,5.93) ; v2(87.55,2.17) v2(86.55,2.17) v2(85.55,2.17) ; v2(69.55,5.93) v2(70.55,5.93) v2(71.55,5.93) ; 86.04,5.93 86.04,5.03 arc(86.04,5.01) 86.05,5 ; 59.06,5.81 59.06,5.32 arc(59.05,5.3) 59.04,5.28 ; v2(56.55,2.17) v2(57.55,2.17) ; 36.05,5.29 36.05,5.81 arc(36.05,5.82) 36.06,5.83 ; 74.06,5.84 74.06,5.32 arc(74.05,5.26) 74.01,5.2 ; v2(58.55,2.17) v2(59.55,2.17) ; v2(27.55,5.93) v2(28.55,5.93) ; v2(22.55,5.93) v2(23.55,5.93) ; v2(41.55,5.93) v2(42.55,5.93) ; v2(65.55,2.17) v2(66.55,2.17) v2(67.55,2.17) ; 79.05,5.87 79.05,5.09 arc(79.06,5.03) 79.09,4.99 ; 82.04,5.86 82.04,5.49 arc(82.04,5.47) 82.06,5.45 ; v2(30.55,2.17) v2(31.55,2.17) v2(32.55,2.17) ; v2(50.55,5.93) v2(49.55,5.93) v2(48.55,5.93) ; v2(41.55,2.17) v2(42.55,2.17) ; 83.05,5.91 83.05,5.02 arc(83.06,5) 83.07,4.98 ; v2(27.55,2.17) v2(28.55,2.17) ; v2(89.55,5.93) v2(90.55,5.93) ; 62.06,5.84 62.06,5.24 arc(62.05,5.21) 62.03,5.19 ; 90.05,5.87 90.05,5.27 arc(90.06,5.23) 90.08,5.19 ; 35.07,5.48 35.07,5.83 arc(35.06,5.88) 35.03,5.93 ; 70.05,5.85 70.05,5.25 arc(70.05,5.22) 70.04,5.2 ; v2(56.55,5.93) v2(57.55,5.93) ; v2(25.55,2.17) v2(26.55,2.17) ; 63.04,5.84 63.04,5.05 arc(63.03,5.04) 63.03,5.03 ; 71.06,5.17 71.06,5.75 arc(71.06,5.77) 71.05,5.78 ; 23.04,5.27 arc(23.02,5.23) 22.99,5.2 ; 23.04,5.27 arc(23.05,5.26) 23.05,5.25 ; 23.11,5.22 arc(23.14,5.26) 23.15,5.31
  Top Layer w0.508: 14.96,5.38 14.96,5.8 arc(15.05,6.29) 15.33,6.7 ; 12.05,5.24 12.05,5.84 arc(12.14,6.3) 12.4,6.69
  Top Layer w0.559: 26.03,5.93 26.03,5.41 arc(26.04,5.39) 26.05,5.37
  Inner3 w0.254: 42.56,2.22 43.51,2.19 ; 23.51,2.2 24.45,2.19 ; 26.6,2.2 27.54,2.16 ; 28.57,2.16 29.52,2.16 ; 59.65,2.16 60.54,2.17 ; 90.54,2.17 91.49,2.17 ; 57.59,2.2 58.5,2.17
  Bottom Layer w0.132: U6.1 49.74,88.48 arc(49.79,88.21) C103.1
  Bottom Layer w0.254: 28.88,96.31 30.91,96.31 arc(31.07,96.34) 31.2,96.43 ; 29.24,92.99 30.85,92.99 arc(31.21,92.91) 31.51,92.71 ; 31.43,96.31 31.43,93.23 arc(31.4,93.08) 31.31,92.95
  Bottom Layer w0.45: 38.04,3.99 38.04,5.88 arc(38.04,5.9) 38.06,5.92 ; 81.07,5.79 81.07,5.17 arc(81.06,5.11) 81.03,5.06 ; v2(77.55,2.17) v2(76.55,2.17) v2(75.55,2.17) ; v2(32.55,2.17) v2(33.55,2.17) v2(34.55,2.17) ; v2(81.55,2.17) v2(80.55,2.17) v2(79.55,2.17) ; v2(27.55,5.93) 28.07,5.93 ; 28.07,5.93 28.07,4.94 arc(28.08,4.89) 28.11,4.85 ; 28.07,5.93 28.07,5.94 ; 28.07,5.93 v2(28.55,5.93) ; v2(91.55,2.17) 91.59,2.17 arc(91.8,2.21) 91.97,2.33 arc(92.03,2.42) 92.05,2.52 F1.A82 92.05,5.7 arc(92.04,5.74) 92.02,5.77 arc(91.84,5.89) 91.62,5.93 v2(91.55,5.93) ; 30.03,5.87 30.03,4.79 ; v2(48.55,5.93) v2(47.55,5.93) v2(46.55,5.93) ; 88.03,5.83 88.03,5.01 arc(88.03,5) 88.04,4.99 ; 59.08,5.83 59.08,5.29 arc(59.07,5.25) 59.05,5.21 ; v2(81.55,5.93) v2(80.55,5.93) v2(79.55,5.93) ; v2(58.55,5.93) v2(59.55,5.93) ; v2(29.55,5.93) v2(30.55,5.93) ; 34.05,5.9 34.05,5.01 ; v2(52.55,2.17) v2(51.55,2.17) v2(50.55,2.17) ; v2(43.55,5.93) v2(44.55,5.93) ; v2(22.55,5.93) 22.4,5.93 arc(22.33,5.92) 22.27,5.88 arc(22.11,5.63) 22.05,5.35 F1.A12 22.05,2.39 arc(22.06,2.33) 22.1,2.27 arc(22.21,2.2) 22.34,2.17 v2(22.55,2.17) v2(23.55,2.17) ; v2(43.55,2.17) v2(44.55,2.17) ; 41.05,5.8 41.05,4.96 arc(41.03,4.86) 40.97,4.77 ; 65.06,5.93 65.06,5.08 arc(65.05,5.02) 65.02,4.98 ; 89.05,5.85 89.05,5.23 arc(89.05,5.22) 89.05,5.22 ; v2(36.55,2.17) v2(37.55,2.17) v2(38.55,2.17) ; v2(58.55,2.17) v2(59.55,2.17) ; v2(60.55,5.93) v2(61.55,5.93) ; v2(65.55,2.17) v2(64.55,2.17) v2(63.55,2.17) ; 48.06,5.86 48.06,5.11 arc(48.07,5.07) 48.09,5.03 ; 55.04,5.86 55.04,5.29 arc(55.03,5.26) 55.02,5.24 ; v2(29.55,2.17) v2(30.55,2.17) ; v2(63.55,5.93) v2(64.55,5.93) v2(65.55,5.93) ; v2(36.55,5.93) v2(37.55,5.93) v2(38.55,5.93) ; 33.06,4.66 33.06,5.79 arc(33.05,5.83) 33.03,5.86 ; 80.05,5.78 80.05,5.28 arc(80.05,5.26) 80.04,5.25 ; v2(87.55,2.17) v2(88.55,2.17) v2(89.55,2.17) ; v2(50.55,5.93) v2(51.55,5.93) v2(52.55,5.93) ; 25.06,5.92 25,5.24 arc(25,5.21) 25.02,5.18 ; v2(71.55,2.17) v2(72.55,2.17) v2(73.55,2.17) ; v2(27.55,2.17) v2(28.55,2.17) ; 37.06,5.92 37.06,4.96 arc(37.07,4.88) 37.12,4.82 ; v2(46.55,2.17) v2(47.55,2.17) v2(48.55,2.17) ; v2(69.55,2.17) v2(68.55,2.17) v2(67.55,2.17) ; 76.05,5.86 76.05,5.36 arc(76.04,5.3) 76.01,5.25 ; v2(85.55,5.93) v2(84.55,5.93) v2(83.55,5.93) ; v2(40.55,2.17) v2(41.55,2.17) ; v2(24.55,5.93) v2(25.55,5.93) ; v2(67.55,5.93) v2(68.55,5.93) v2(69.55,5.93) ; v2(75.55,5.93) v2(76.55,5.93) v2(77.55,5.93) ; v2(73.55,5.93) v2(72.55,5.93) v2(71.55,5.93) ; 72.05,5.92 72.05,5.17 arc(72.06,5.14) 72.07,5.12 ; v2(54.55,5.93) v2(55.55,5.93) v2(56.55,5.93) ; v2(32.55,5.93) v2(33.55,5.93) v2(34.55,5.93) ; 84.07,5.12 84.07,5.69 arc(84.06,5.75) 84.03,5.8 ; 44.07,5.84 44.07,4.72 arc(44.06,4.7) 44.05,4.67 ; 51.05,5.84 51.05,5.13 ; 69.07,5.93 69.07,5.17 arc(69.06,5.12) 69.03,5.07 ; 47.04,5.89 47.04,5.06 arc(47.04,5.04) 47.06,5.02 ; v2(40.55,5.93) v2(41.55,5.93) ; 56.06,5.86 56.06,4.04 arc(56.06,4.02) 56.05,4 ; v2(54.55,2.17) v2(55.55,2.17) v2(56.55,2.17) ; 85.03,5.84 85.03,5.13 arc(85.03,5.1) 85.02,5.08 ; v2(87.55,5.93) v2(88.55,5.93) v2(89.55,5.93) ; 52.04,5.84 52.04,5.15 arc(52.03,5.12) 52.02,5.1 ; 73.06,5.93 73.06,5.39 arc(73.04,5.32) 73,5.26 ; v2(60.55,2.17) v2(61.55,2.17) ; v2(24.55,2.17) v2(25.55,2.17) ; 68.04,5.89 68.04,5.24 arc(68.04,5.21) 68.06,5.19 ; v2(85.55,2.17) v2(84.55,2.17) v2(83.55,2.17) ; 25.06,5.18 25.06,4.97 arc(25.05,4.92) 25.02,4.88 ; 61.06,5.87 61.06,5.22 arc(61.05,5.19) 61.04,5.17 ; 64.03,5.93 64.03,5.22 arc(64.04,5.13) 64.09,5.06 ; 77.05,5.81 77.05,5.27 arc(77.05,5.26) 77.04,5.24
  Bottom Layer w0.508: 12.03,5.37 12.03,5.6 arc(12.15,6.15) 12.46,6.63
  vias: v1(5.44,98.07) v1(5.44,92.99) v1(5.44,87.91) v1(5.51,85.16) v1(5.45,73.71) v1(5.44,32.03) v1(5.44,26.95) v1(5.44,21.87) v1(5.47,17.13) v1(5.44,11.71) v1(5.58,18.87) v1(6.74,72.48) v1(10.52,32.03) v1(10.52,16.79) v1(10.52,12.05) v1(12.38,6.65) v1(14.38,81.42) v1(14.44,69.91) v1(15.36,6.66) v1(15.6,98.07) v1(15.6,92.99) v1(15.6,26.95) v1(15.6,21.87) v1(15.6,16.79) v1(15.6,11.71) v1(15.62,82.56) v1(15.68,76.25) v1(16.97,73.71) v1(17.71,81.46) v1(20.68,98.07) v1(20.68,92.99) v1(20.68,21.87) v1(20.68,16.79) v1(20.68,11.71) v1(25.02,76.19) v1(25.76,98.07) v1(28.92,96.31) v1(29.91,83.62) v1(30.84,98.41) v1(35.92,83.17) v1(39.58,96.68) v1(41,98.07) v1(41,87.91) v1(41,78.09) v1(46.08,98.07) v1(46.08,92.99) v1(46.08,82.83) v1(46.08,73.01) v1(46.18,87.99) v1(49.78,90.33) v1(49.93,87.99) v1(51.16,98.07) v1(51.16,87.91) v1(51.16,82.83) v1(51.16,77.75) v1(51.16,72.67) v1(51.16,62.85) v1(51.16,57.77) v1(51.16,52.69) v1(53.01,97.22) v1(53.11,95.8) v1(56.24,98.07) v1(56.24,87.91) v1(56.24,82.83) v1(56.24,77.75) v1(56.24,72.67) v1(56.24,67.59) v1(56.24,62.51) v1(56.24,57.77) v1(56.24,52.69) v1(56.24,47.61) v1(61.32,98.07) v1(61.32,87.91) v1(61.32,82.83) v1(61.32,77.75) v1(61.32,72.67) v1(61.32,67.59) v1(61.32,62.51) v1(61.32,57.43) v1(61.32,52.69) v1(61.32,47.61) v1(61.32,42.53) v1(66.4,98.07) v1(66.4,92.99) v1(66.4,87.91) v1(66.4,82.83) v1(66.4,72.67) v1(66.4,67.59) v1(66.4,57.43) v1(66.4,52.35) v1(66.4,47.61) v1(66.4,42.53) v1(66.4,37.45) v1(67.51,84.89) v1(67.49,77.74) v1(67.49,70.64) v1(67.56,62.88) v1(71.48,98.07) v1(71.48,92.99) v1(71.48,87.91) v1(71.48,82.83) v1(71.48,72.67) v1(71.48,67.59) v1(71.48,57.43) v1(71.48,52.35) v1(71.48,47.27) v1(71.48,42.53) v1(71.48,37.45) v1(76.56,87.91) v1(76.56,82.83) v1(76.56,77.75) v1(76.56,72.67) v1(76.56,67.59) v1(76.56,62.51) v1(76.56,57.43) v1(76.56,52.35) v1(76.56,47.27) v1(76.56,42.19) v1(76.56,37.45) v1(81.64,98.07) v1(81.64,92.99) v1(81.64,87.91) v1(81.64,83.17) v1(81.64,67.59) v1(81.64,57.43) v1(81.64,52.35) v1(81.64,47.27) v1(81.64,42.19) v1(81.64,37.11) v1(86.72,98.07) v1(86.72,92.99) v1(86.72,87.91) v1(86.72,82.83) v1(86.72,77.75) v1(86.72,72.67) v1(86.72,67.59) v1(86.72,62.51) v1(86.72,57.43) v1(86.72,52.35) v1(86.72,47.27) v1(86.72,42.19) v1(86.72,37.11) v1(86.72,32.03) v1(91.8,92.99) v1(91.8,88.25) v1(91.8,82.83) v1(91.8,77.75) v1(91.8,62.51) v1(91.8,57.43) v1(91.8,52.35) v1(91.8,47.27) v1(91.8,42.19) v1(91.8,37.11) v1(91.8,32.03) v1(91.8,26.95) v1(91.8,21.87) v1(91.8,16.79) v1(91.8,11.71) v2(5.49,81.35) v2(5.49,69.92) v2(5.49,68.65) v2(5.49,64.84) v2(5.49,62.3) v2(5.49,59.76) v2(5.49,55.95) v2(5.49,52.14) v2(5.49,48.33) v2(5.49,44.52) v2(5.49,40.71) v2(6.76,82.62) v2(6.76,68.65) v2(6.76,67.38) v2(6.76,63.57) v2(6.76,62.3) v2(6.76,59.76) v2(6.76,55.95) v2(6.76,52.14) v2(6.76,48.33) v2(6.76,44.52) v2(6.76,40.71) v2(6.76,36.9) v2(8.03,73.73) v2(8.03,64.84) v2(8.03,62.3) v2(8.03,59.76) v2(8.03,55.95) v2(8.03,52.14) v2(8.03,48.33) v2(8.03,44.52) v2(8.03,40.71) v2(8.03,36.9) v2(9.3,67.38) v2(9.3,63.57) v2(9.3,62.3) v2(9.3,59.76) v2(9.3,55.95) v2(9.3,52.14) v2(9.3,48.33) v2(9.3,44.52) v2(9.3,40.71) v2(9.3,36.9) v2(10.57,67.38) v2(10.57,66.11) v2(10.57,64.84) v2(10.57,62.3) v2(10.57,59.76) v2(10.57,55.95) v2(10.57,52.14) v2(10.57,48.33) v2(10.57,44.52) v2(10.57,40.71) v2(10.57,36.9) v2(11.84,67.38) v2(11.84,66.11) v2(11.84,64.84) v2(11.84,62.3) v2(11.84,59.76) v2(11.84,55.95) v2(11.84,52.14) v2(11.84,48.33) v2(11.84,44.52) v2(11.84,40.71) v2(11.84,36.9) v2(13.11,67.38) v2(13.11,63.57) v2(13.11,62.3) v2(13.11,59.76) v2(13.11,55.95) v2(13.11,52.14) v2(13.11,48.33) v2(13.11,44.52) v2(13.11,40.71) v2(13.11,36.9) v2(14.38,64.84) v2(14.38,59.76) v2(14.38,55.95) v2(14.38,52.14) v2(14.38,48.33) v2(14.38,44.52) v2(14.38,40.71) v2(14.38,36.9) v2(15.65,67.38) v2(15.65,63.57) v2(15.65,62.3) v2(15.65,59.76) v2(15.65,55.95) v2(15.65,52.14) v2(15.65,48.33) v2(15.65,44.52) v2(15.65,40.71) v2(15.65,36.9) v2(16.92,64.84) v2(16.92,59.76) v2(16.92,55.95) v2(16.92,52.14) v2(16.92,48.33) v2(16.92,44.52) v2(16.92,40.71) v2(16.92,36.9)
ADJ: length 23.9
  Bottom Layer w0.254: 23.83,96.17 23.83,94.49 arc(23.85,94.41) 23.9,94.33 ; 39.05,90.65 38.99,90.59 arc(38.17,90.04) 37.2,89.85 24.82,89.85 arc(24.56,89.9) 24.34,90.05 arc(24.06,90.46) 23.97,90.94 23.97,91.59 ; 39.51,95.88 39.51,92.66 arc(39.5,92.62) 39.48,92.59 39.48,91.55 arc(39.38,91.04) 39.09,90.61
CLK+: length 79
  Top Layer w0.132: 10.57,77.54 10.93,77.54 arc(10.99,77.53) 11.04,77.5 arc(11.07,77.45) 11.09,77.38 11.09,35.12 arc(11.28,34.14) 11.83,33.32 22.76,22.39 arc(23.26,21.64) 23.43,20.76 23.43,8.12 arc(23.37,7.78) v2(23.17,7.5)
  Bottom Layer w0.131: v2(23.17,7.5) 23.17,7.32 arc(23.21,7.15) 23.3,7.01 arc(23.4,6.86) 23.43,6.69 23.43,6.67 arc(23.4,6.49) 23.29,6.33 23.14,6.18 arc(23.08,6.08) 23.05,5.96 23.05,4.12
CLK-: length 79
  Top Layer w0.132: 11.84,77.54 11.48,77.54 arc(11.42,77.53) 11.37,77.5 arc(11.33,77.45) 11.32,77.38 11.32,35.12 arc(11.49,34.23) 11.99,33.49 22.92,22.56 arc(23.47,21.73) 23.67,20.76 23.67,8.12 arc(23.74,7.78) v2(23.93,7.5)
  Bottom Layer w0.131: v2(23.93,7.5) 23.93,7.32 arc(23.89,7.15) 23.8,7.01 arc(23.7,6.86) 23.67,6.69 23.67,6.67 arc(23.7,6.49) 23.81,6.33 23.96,6.18 arc(24.03,6.08) 24.05,5.96 24.05,4.12
I2CADDR0: length 63.5
  Inner2 w0.254: 52.16,97.14 43.52,97.14 arc(42.55,96.95) 41.73,96.4 23.17,77.84 arc(22.62,77.02) 22.43,76.05 22.43,68.43 arc(22.37,68.14) 22.2,67.9 20.35,66.04 arc(19.57,65.52) 18.65,65.34 9.27,65.34 arc(9.09,65.3) 8.94,65.2 8.72,64.99 arc(8.58,64.77) 8.53,64.51 8.53,63.77 arc(8.51,63.7) 8.47,63.64 8.25,63.42 8.13,63.42
  vias: v1(52.16,97.22) v2(8.03,63.57)
I2CADDR1: length 55.7
  Inner2 w0.254: 14.34,63.66 14.6,63.92 arc(14.94,64.16) 15.35,64.24 19.65,64.24 arc(20.33,64.37) 20.91,64.76 23.04,66.89 arc(23.59,67.71) 23.78,68.68 23.78,75.44 arc(23.96,76.3) 24.45,77.04 42.38,94.97 arc(43.21,95.52) 44.18,95.72 52.03,95.72
  vias: v1(52.19,95.76) v2(14.38,63.57)
JTAG_SEL:
  vias: v2(14.38,62.3)
JTAG_TCLK:
  vias: v2(14.38,61.03)
JTAG_TDI:
  vias: v2(11.84,61.03)
JTAG_TDO:
  vias: v2(13.11,61.03)
JTAG_TMS:
  vias: v2(15.65,61.03)
JTAG_TRST#:
  vias: v2(16.92,61.03)
PCIET0+: length 4.9
  Bottom Layer w0.131: F1.A16 26.05,5.94 arc(26.07,6.03) 26.13,6.12 26.36,6.35 arc(26.42,6.43) 26.44,6.53 26.43,7.22 arc(26.43,7.22) 26.44,7.23 arc(26.44,7.23) 26.44,7.23 26.44,7.62 arc(26.39,7.87) 26.25,8.09 arc(26.1,8.3) 26.05,8.55 C61.1
PCIET0-: length 4.9
  Bottom Layer w0.131: C62.1 27.06,8.55 arc(27.01,8.3) 26.86,8.09 arc(26.72,7.87) 26.67,7.62 26.67,7.14 arc(26.67,7.13) 26.67,7.13 ; F1.A17 27.05,5.94 arc(27.03,6.03) 26.98,6.12 26.74,6.35 arc(26.69,6.43) 26.67,6.53 26.67,7.13
PCIET1+: length 4.9
  Bottom Layer w0.131: F1.A21 31.05,5.94 arc(31.07,6.03) 31.13,6.12 31.36,6.35 arc(31.42,6.43) 31.44,6.53 31.43,7.22 ; C1.1 31.05,8.55 arc(31.1,8.3) 31.24,8.09 arc(31.39,7.87) 31.44,7.62 31.44,7.23
PCIET1-: length 4.9
  Bottom Layer w0.131: 31.67,7.13 31.67,6.53 arc(31.69,6.43) 31.74,6.35 31.98,6.12 arc(32.03,6.03) 32.05,5.94 F1.A22 ; C2.1 32.05,8.55 arc(32,8.3) 31.86,8.09 arc(31.72,7.87) 31.67,7.62 31.67,7.13 arc(31.67,7.13) 31.67,7.13
PCIET2+: length 4.9
  Bottom Layer w0.131: F1.A25 35.05,5.94 arc(35.07,6.03) 35.13,6.12 35.36,6.35 arc(35.42,6.43) 35.44,6.53 35.43,7.22 ; C3.1 35.05,8.55 arc(35.1,8.3) 35.24,8.09 arc(35.39,7.87) 35.44,7.62 35.44,7.23
PCIET2-: length 4.9
  Bottom Layer w0.131: F1.A26 36.05,5.94 arc(36.03,6.03) 35.98,6.12 35.74,6.35 arc(35.69,6.43) 35.67,6.53 35.67,7.13 ; C4.1 36.05,8.55 arc(36,8.3) 35.86,8.09 arc(35.72,7.87) 35.67,7.62 35.67,7.13 arc(35.67,7.13) 35.67,7.13
PCIET3+: length 4.9
  Bottom Layer w0.131: F1.A29 39.05,5.94 arc(39.07,6.03) 39.13,6.12 39.36,6.35 arc(39.42,6.43) 39.44,6.53 39.44,7.13 ; C5.1 39.05,8.55 arc(39.1,8.3) 39.24,8.09 arc(39.39,7.87) 39.44,7.62 39.44,7.15
PCIET3-: length 4.9
  Bottom Layer w0.131: F1.A30 40.05,5.94 arc(40.03,6.03) 39.98,6.12 39.74,6.35 arc(39.69,6.43) 39.67,6.53 39.67,7.13 ; 39.67,7.14 39.67,7.62 arc(39.72,7.87) 39.86,8.09 arc(40,8.3) 40.05,8.55 C6.1
PCIET4+: length 4.9
  Bottom Layer w0.132: F1.A35 45.05,5.88 arc(45.09,6.1) 45.22,6.28 arc(45.37,6.51) 45.42,6.78 ; 45.43,6.78 45.43,7.88 arc(45.33,8.38) C7.1
PCIET4-: length 5
  Bottom Layer w0.132: F1.A36 46.05,5.8 arc(45.99,6.09) 45.83,6.34 ; C8.1 arc(45.76,8.38) 45.66,7.88 45.66,6.81 arc(45.72,6.53) 45.88,6.29
PCIET5+: length 4.9
  Bottom Layer w0.131: C9.1 49.05,8.55 arc(49.1,8.3) 49.24,8.09 arc(49.38,7.88) 49.43,7.63 49.43,7.13 arc(49.43,7.13) 49.43,7.13 49.44,6.53 arc(49.42,6.43) 49.36,6.35 49.13,6.12 arc(49.07,6.03) 49.05,5.94 F1.A39
PCIET5-: length 4.9
  Bottom Layer w0.131: C10.1 50.05,8.55 arc(50,8.3) 49.86,8.09 arc(49.71,7.88) 49.67,7.63 49.67,7.23 arc(49.67,7.23) 49.67,7.23 arc(49.67,7.22) 49.67,7.22 49.67,6.53 arc(49.69,6.43) 49.74,6.35 49.98,6.12 arc(50.03,6.03) 50.05,5.94 F1.A40
PCIET6+: length 4.9
  Bottom Layer w0.131: 53.44,7.23 53.44,7.62 arc(53.39,7.87) 53.24,8.09 arc(53.1,8.3) 53.05,8.55 C11.1 ; F1.A43 53.05,5.94 arc(53.07,6.03) 53.13,6.12 53.36,6.35 arc(53.42,6.43) 53.43,6.53 53.43,7.22
PCIET6-: length 4.9
  Bottom Layer w0.131: F1.A44 54.05,5.94 arc(54.03,6.03) 53.98,6.12 53.74,6.35 arc(53.69,6.43) 53.67,6.53 53.67,7.62 arc(53.72,7.87) 53.86,8.09 arc(54,8.3) 54.05,8.55 C12.1
PCIET7+: length 4.9
  Bottom Layer w0.131: F1.A47 57.05,5.94 arc(57.07,6.03) 57.13,6.12 57.36,6.35 arc(57.42,6.43) 57.43,6.53 57.43,7.22 arc(57.43,7.22) 57.44,7.23 arc(57.44,7.23) 57.44,7.23 57.44,7.62 arc(57.39,7.87) 57.25,8.09 arc(57.1,8.3) 57.06,8.55 C13.1
PCIET7-: length 4.9
  Bottom Layer w0.131: C14.1 58.06,8.55 arc(58.01,8.3) 57.86,8.09 arc(57.72,7.87) 57.67,7.62 57.67,7.14 arc(57.67,7.13) 57.67,7.13 ; 57.67,7.13 57.67,6.53 arc(57.69,6.43) 57.74,6.35 57.98,6.12 arc(58.03,6.03) 58.05,5.94 F1.A48
PCIET8+: length 4.9
  Bottom Layer w0.131: 62.43,7.22 62.43,6.53 arc(62.42,6.43) 62.36,6.35 62.13,6.12 arc(62.07,6.03) 62.05,5.94 F1.A52 ; C15.1 62.05,8.55 arc(62.1,8.3) 62.24,8.09 arc(62.39,7.87) 62.44,7.62 62.44,7.23
PCIET8-: length 4.9
  Bottom Layer w0.131: F1.A53 63.05,5.94 arc(63.03,6.03) 62.98,6.12 62.74,6.35 arc(62.69,6.43) 62.67,6.53 62.67,7.62 arc(62.72,7.87) 62.86,8.09 arc(63,8.3) 63.05,8.55 C16.1
PCIET9+: length 4.9
  Bottom Layer w0.131: F1.A56 66.05,5.94 arc(66.07,6.03) 66.13,6.12 66.36,6.35 arc(66.42,6.43) 66.43,6.53 66.43,7.13 arc(66.43,7.13) 66.43,7.13 66.43,7.62 arc(66.38,7.87) 66.24,8.09 arc(66.1,8.3) 66.05,8.55 C17.1
PCIET9-: length 4.9
  Bottom Layer w0.131: 66.67,7.22 66.67,6.53 arc(66.69,6.43) 66.74,6.35 66.98,6.12 arc(67.03,6.03) 67.05,5.94 F1.A57 ; C18.1 67.05,8.55 arc(67,8.3) 66.86,8.09 arc(66.72,7.87) 66.67,7.62 66.67,7.23
PCIET10+: length 4.9
  Bottom Layer w0.131: C19.1 70.05,8.55 arc(70.1,8.3) 70.24,8.09 arc(70.38,7.87) 70.43,7.62 70.43,7.13 arc(70.43,7.13) 70.43,7.13 70.43,6.53 arc(70.42,6.43) 70.36,6.35 70.13,6.12 arc(70.07,6.03) 70.05,5.94 F1.A60
PCIET10-: length 4.9
  Bottom Layer w0.131: F1.A61 71.05,5.94 arc(71.03,6.03) 70.98,6.12 70.74,6.35 arc(70.69,6.43) 70.67,6.53 70.67,7.22 arc(70.67,7.22) 70.67,7.23 arc(70.67,7.23) 70.66,7.23 70.66,7.62 arc(70.71,7.87) 70.86,8.09 arc(71,8.3) 71.05,8.55 C20.1
PCIET11+: length 4.9
  Bottom Layer w0.131: F1.A64 74.05,5.94 arc(74.07,6.03) 74.13,6.12 74.36,6.35 arc(74.42,6.43) 74.43,6.53 74.43,7.62 arc(74.38,7.87) 74.24,8.09 arc(74.1,8.3) 74.05,8.55 C21.1
PCIET11-: length 5.1
  Bottom Layer w0.131: C22.1 75.05,8.55 arc(75,8.3) 74.86,8.09 arc(74.72,7.87) 74.67,7.62 74.67,7.15 arc(74.67,7.14) 74.67,7.13 74.67,6.96 ; 74.67,7.13 74.67,6.53 arc(74.69,6.43) 74.74,6.35 74.98,6.12 arc(75.03,6.03) 75.05,5.94 F1.A65
PCIET12+: length 4.9
  Bottom Layer w0.131: 78.44,7.23 78.44,7.62 arc(78.39,7.87) 78.24,8.09 arc(78.1,8.3) 78.05,8.55 C23.1 ; 78.43,7.22 78.43,6.53 arc(78.42,6.43) 78.36,6.35 78.13,6.12 arc(78.07,6.03) 78.05,5.94 F1.A68
PCIET12-: length 4.9
  Bottom Layer w0.131: C24.1 79.05,8.55 arc(79,8.3) 78.86,8.09 arc(78.72,7.87) 78.67,7.62 78.67,6.53 arc(78.69,6.43) 78.74,6.35 78.98,6.12 arc(79.03,6.03) 79.05,5.94 F1.A69
PCIET13+: length 4.9
  Bottom Layer w0.131: C25.1 82.05,8.55 arc(82.1,8.3) 82.24,8.09 arc(82.39,7.87) 82.44,7.62 82.43,6.53 arc(82.42,6.43) 82.36,6.35 82.13,6.12 arc(82.07,6.03) 82.05,5.94 F1.A72
PCIET13-: length 4.9
  Bottom Layer w0.131: C26.1 83.05,8.55 arc(83,8.3) 82.86,8.09 arc(82.72,7.87) 82.67,7.62 82.67,6.53 arc(82.69,6.43) 82.74,6.35 82.98,6.12 arc(83.03,6.03) 83.05,5.94 F1.A73
PCIET14+: length 4.9
  Bottom Layer w0.131: C27.1 86.05,8.55 arc(86.1,8.3) 86.24,8.09 arc(86.38,7.88) 86.43,7.63 86.43,7.13 arc(86.43,7.13) 86.43,7.13 86.43,6.53 arc(86.42,6.43) 86.36,6.35 86.13,6.12 arc(86.07,6.03) 86.05,5.94 F1.A76
PCIET14-: length 4.9
  Bottom Layer w0.131: C28.1 87.05,8.55 arc(87,8.3) 86.86,8.09 arc(86.71,7.88) 86.66,7.63 86.66,7.23 arc(86.67,7.23) 86.67,7.23 arc(86.67,7.22) 86.67,7.22 86.67,6.53 arc(86.69,6.43) 86.74,6.35 86.98,6.12 arc(87.03,6.03) 87.05,5.94 F1.A77
PCIET15+: length 4.9
  Bottom Layer w0.131: C29.1 90.05,8.55 arc(90.1,8.3) 90.24,8.09 arc(90.39,7.87) 90.44,7.62 90.44,7.23 ; F1.A80 90.05,5.94 arc(90.07,6.03) 90.13,6.12 90.36,6.35 arc(90.42,6.43) 90.43,6.53 90.43,7.22
PCIET15-: length 4.9
  Bottom Layer w0.131: C30.1 91.05,8.55 arc(91,8.3) 90.86,8.09 arc(90.72,7.87) 90.67,7.62 90.67,6.53 arc(90.69,6.43) 90.74,6.35 90.98,6.12 arc(91.03,6.03) 91.05,5.94 F1.A81
PERST#: length 72.2
  Bottom Layer w0.254: 19.07,5.55 19.07,9.71 arc(18.88,10.68) 18.33,11.5 2.57,27.26 arc(2.02,28.09) 1.83,29.06 1.83,60.1 arc(2.02,61.07) 2.57,61.89 3.05,62.37 arc(3.69,62.8) 4.45,62.95 9.17,62.95 arc(10.02,63.12) 10.73,63.6
  vias: v2(10.57,63.57)
